# Altium project HallFieldMeter.PrjPCB
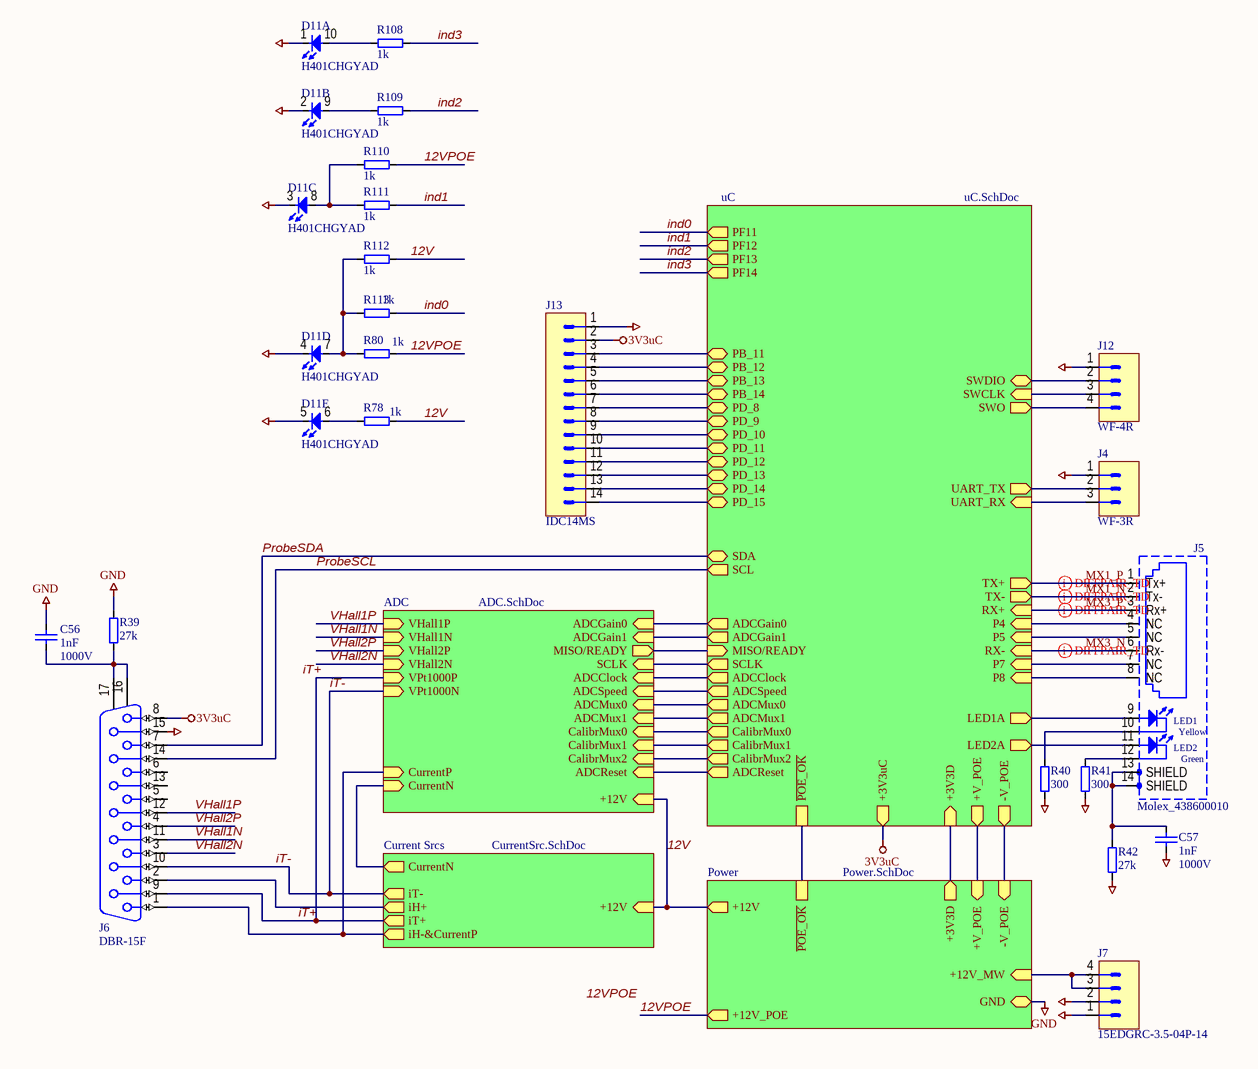
[diagram p0: main.SchDoc]
5 sheets, 296 parts. Net scope: hierarchical (ports join the sheet entries above them; power ports are global).
Board file: HallFM2_2.PcbDoc
Sheets:
  main.SchDoc
    ADC = ADC.SchDoc
    Current Srcs = CurrentSrc.SchDoc
    uC = uC.SchDoc
    Power = Power.SchDoc

## Sheet main.SchDoc
size 420 x 297 mm; Address1: Address1; Address2: Address2; Address3: Address3; Address4: Address4; SheetNumber: 1; Scale: 1:1; Разраб.: Иванов; Обозначение документа: АБВГ.123456.001 Э3; Пров.: Петров; Утв.: Сидоров; Наименование организации: ОАО "Концерн "МПО-Гидроприбор"; Перв. применение: АБВГ.123456.000; Наименование изделия 1: MAiN; Наименование изделия 2: Схема электрическая; Наименование изделия 3: принципиальная; Нач. отд.: Нач. отд.; Фамилия нач. отд.: Сидоров

### Parts
C56  1nF  Voltage: 1000V  [CAPC1206]
C57  1nF  Voltage: 1000V  [CAPC1206]
D11  H401CHGYAD  [H401CHGYAD_LED_CB]  (parts A,B,C,D,E of 5)
J4  WF-3R  [MOLEX_22-05-7038]
J5  Molex_438600010  [Molex-43860-0010]
J6  DBR-15F  [AMPHENOL_L717DFA15S1ATN]
J7  15EDGRC-3.5-04P-14  [TE_284512-4]
J12  WF-4R  [MOLEX_WF4-angle]
J13  IDC14MS  [3M_2514-6002RB]
R39  27k  [SMD0805RES]
R40  300  [RESC1608X64N]
R41  300  [RESC1608X64N]
R42  27k  [SMD0805RES]
R78  1k  [SMD0805RES]
R80  1k  [SMD0805RES]
R108  1k  [SMD0805RES]
R109  1k  [SMD0805RES]
R110  1k  [SMD0805RES]
R111  1k  [SMD0805RES]
R112  1k  [SMD0805RES]
R113  1k  [SMD0805RES]

### Sub-sheets
ADC = ADC.SchDoc: ADCGain1 (in), ADCGain0 (in), MISO/READY (out), SCLK (in), ADCClock (in), ADCSpeed (in), ADCMux0 (in), ADCMux1 (in), CalibrMux0 (in), CalibrMux1 (in), CalibrMux2 (in), +12V (in), VHall1P (in), VHall1N (in), VHall2P (in), VHall2N (in), CurrentP (in), CurrentN (in), VPt1000P (in), VPt1000N (in), ADCReset (in)
Current Srcs = CurrentSrc.SchDoc: +12V (in), iH-&CurrentP (out), iT+ (out), iH+ (out), CurrentN (out), iT- (out)
Power = Power.SchDoc: +V_POE (in), -V_POE (in), +12V_MW (in), GND (bidir), +3V3D (out), +12V (out), ~{POE_OK}, +12V_POE (out)
uC = uC.SchDoc: TX+ (out), TX- (out), RX+ (in), P4 (in), P5 (in), RX- (in), P7 (in), P8 (in), LED1A (out), LED2A (out), +V_POE (out), -V_POE (out), +3V3D (in), UART_TX (out), UART_RX (in), ADCGain0 (out), ADCGain1 (out), MISO/READY (in), SCLK (out), ADCClock (out), ADCSpeed (out), ADCMux0 (out), ADCMux1 (out), CalibrMux0 (out), CalibrMux1 (out), CalibrMux2 (out), SDA (bidir), SCL (out), ADCReset (out), ~{POE_OK}, +3V3uC (out), SWO (out), SWCLK (in), SWDIO (bidir), PD_15 (bidir), PD_14 (bidir), PD_13 (bidir), PD_12 (bidir), PD_11 (bidir), PD_10 (bidir), PD_9 (bidir), PD_8 (bidir), PB_14 (bidir), PB_13 (bidir), PB_12 (bidir), PB_11 (bidir), PF11 (out), PF12 (out), PF13 (out), PF14 (out)

### Nets
3V3uC: J6.8 J13.2 ; sheet uC/+3V3uC
GND: C56.1 C57.1 D11.1(C1) D11.2(C2) D11.3(C3) D11.4(C4) D11.5(C5) J4.1 J6.15 J7.1 J7.2 J12.1 J13.1 R39.2 R40.1 R41.1 R42.1 ; sheet Power/GND
12V: R78.2 R112.2 ; sheet ADC/+12V, sheet Current Srcs/+12V, sheet Power/+12V  [project net +12V]
12VPOE: R80.2 R110.2 ; sheet Power/+12V_POE  [project net +12V_POE]
Hal_current_2mA: J6.2 ; sheet Current Srcs/iH+
ind0: R113.2 ; sheet uC/PF11
ind1: R111.2 ; sheet uC/PF12
ind2: R109.2 ; sheet uC/PF13
ind3: R108.2 ; sheet uC/PF14
iT+: J6.9 ; sheet ADC/VPt1000P, sheet Current Srcs/iT+
iT-: J6.10 ; sheet ADC/VPt1000N, sheet Current Srcs/iT-
MX1_N: J5.2(Tx-) ; sheet uC/TX-
MX1_P: J5.1(Tx+) ; sheet uC/TX+
MX3_N: J5.6(Rx-) ; sheet uC/RX-
MX3_P: J5.3(Rx+) ; sheet uC/RX+
ProbeSCL: J6.14 ; sheet uC/SCL  [project net ProbeEEPROM_SCL]
ProbeSDA: J6.7 ; sheet uC/SDA  [project net ProbeEEPROM_SDA]
VHall1N: J6.11 ; sheet ADC/VHall1N
VHall1P: J6.12 ; sheet ADC/VHall1P
VHall2N: J6.3 ; sheet ADC/VHall2N
VHall2P: J6.4 ; sheet ADC/VHall2P
NetC56_2: C56.2 J6.16 J6.17 R39.1
NetC57_2: C57.2 J5.13(SHIELD) J5.14(SHIELD) R42.2
NetC60_2: sheet uC/+3V3D, sheet Power/+3V3D
NetD3_1: sheet uC/+V_POE, sheet Power/+V_POE
NetD3_3: sheet uC/-V_POE, sheet Power/-V_POE
NetD11_6: D11.6(A5) R78.1
NetD11_7: D11.7(A4) R80.1 R112.1 R113.1
NetD11_8: D11.8(A3) R110.1 R111.1
NetD11_9: D11.9(A2) R109.1
NetD11_10: D11.10(A1) R108.1
NetJ1_1: sheet ADC/CurrentN, sheet Current Srcs/CurrentN
NetJ4_2: J4.2 ; sheet uC/UART_TX
NetJ4_3: J4.3 ; sheet uC/UART_RX
NetJ5_4: J5.4(NC) ; sheet uC/P4
NetJ5_5: J5.5(NC) ; sheet uC/P5
NetJ5_7: J5.7(NC) ; sheet uC/P7
NetJ5_8: J5.8(NC) ; sheet uC/P8
NetJ5_9: J5.9(ALED1) ; sheet uC/LED1A
NetJ5_10: J5.10(CLED1) R40.2
NetJ5_11: J5.11(ALED2) ; sheet uC/LED2A
NetJ5_12: J5.12(CLED2) R41.2
NetJ6_1: J6.1 ; sheet ADC/CurrentP, sheet Current Srcs/iH-&CurrentP
NetJ7_3: J7.3 J7.4 ; sheet Power/+12V_MW
NetJ12_2: J12.2 ; sheet uC/SWDIO
NetJ12_3: J12.3 ; sheet uC/SWCLK
NetJ12_4: J12.4 ; sheet uC/SWO
NetJ13_3: J13.3 ; sheet uC/PB_11
NetJ13_4: J13.4 ; sheet uC/PB_12
NetJ13_5: J13.5 ; sheet uC/PB_13
NetJ13_6: J13.6 ; sheet uC/PB_14
NetJ13_7: J13.7 ; sheet uC/PD_8
NetJ13_8: J13.8 ; sheet uC/PD_9
NetJ13_9: J13.9 ; sheet uC/PD_10
NetJ13_10: J13.10 ; sheet uC/PD_11
NetJ13_11: J13.11 ; sheet uC/PD_12
NetJ13_12: J13.12 ; sheet uC/PD_13
NetJ13_13: J13.13 ; sheet uC/PD_14
NetJ13_14: J13.14 ; sheet uC/PD_15
NetQ2_4: sheet uC/~{POE_OK}, sheet Power/~{POE_OK}
NetR13_2: sheet ADC/ADCGain1, sheet uC/ADCGain1
NetR15_2: sheet ADC/ADCGain0, sheet uC/ADCGain0
NetR16_2: sheet ADC/MISO/READY, sheet uC/MISO/READY
NetR17_2: sheet ADC/SCLK, sheet uC/SCLK
NetR18_2: sheet ADC/ADCReset, sheet uC/ADCReset
NetR21_1: sheet ADC/ADCClock, sheet uC/ADCClock
NetR24_2: sheet ADC/ADCSpeed, sheet uC/ADCSpeed
NetR26_2: sheet ADC/ADCMux0, sheet uC/ADCMux0
NetR27_2: sheet ADC/ADCMux1, sheet uC/ADCMux1
NetR36_1: sheet ADC/CalibrMux0, sheet uC/CalibrMux0
NetR37_1: sheet ADC/CalibrMux1, sheet uC/CalibrMux1
NetR38_1: sheet ADC/CalibrMux2, sheet uC/CalibrMux2

Not connected (* = marked no-connect by the designer): J6 5 6 13

### Layout directives
differential pair: MX1_N, MX1_P, MX3_N, MX3_P

### Notes on the sheet
- Labels drawn without touching a wire or pin: 12VPOE, iT+
- Перв. примен.
- Справ. №
- Подп. и дата
- Инв. № дубл.
- Взам. инв. №
- Разраб.
- Изм.
- Лист
- № докум.
- Подп.
- Дата
- Лит.
- Масса
- Масштаб
- Пров.
- Т.контр.
- Листов
- Инв. № подл.
- Утв.
- Н.контр.
- Копировал
- Формат А3
- (in symbol Molex_438600010) LED1; Yellow; LED2; Green

### Library data of the parts
C56 C57 = C1206: Чип конденсатор 1206; Vendor: Vishay; DielectricType: X5R; SMD Solders: 2; Solder Option: RM; Tolerance: 1%; Pkg: SMD1206; Device: Cap1206; Value: 1nF; Price: 2
D11 = H401CHGYAD: 4LEDs сборка; Vendor: BIVAR; Value: HGYAD; SMD Solders: 0; Solder Option: RM; Pkg: SMD0603; Device: H401C; THD Solders: 8; Price: 700; Name to order: H401CHGYAD
J4 = WF3R: Вилка  WF3 угловая; Vendor: Confly; SMD Solders: 0; Solder Option: RM; THD Solders: 3; Price: 20; Device: WF-3R; Name to order: WF-3R
J5 = Molex_438600010: 1 Port, 8 Positions, CAT5 RJ45 Modular Connector With Yellow And Green fibers for LEDs; Vendor: Molex; SMD Solders: 4; Solder Option: RM; THD Solders: 10; Price: 320; Pkg: Molex_438600010; Device: Molex_438600010; Name to order: 438600010
J6 = D_SUB_15F: Вилка  DSUB 9 угловая; Vendor: Connfly; SMD Solders: 0; Solder Option: RM; THD Solders: 17; Name to order: DRB- 15MA (DBR-15F) (DS1037-15F); Price: 50; Device: DBR-15F
J7 = 15EDGRC-3.5-04P-14: Вилка  WF4; Vendor: Degson; SMD Solders: 0; Solder Option: RM; THD Solders: 4; Price: 50; Device: 15EDGRC-3.5-04P-14; Name to order: 15EDGRC-3.5-04P-14
J12 = WF4R: Вилка  WF4 угловая; Vendor: Confly; SMD Solders: 0; Solder Option: RM; THD Solders: 4; Price: 20; Device: WF-4R; Name to order: WF-4R
J13 = IDC14MS: Вилка  14конт., шаг: 2.54мм; Vendor: Connfly; SMD Solders: 0; Solder Option: RM; THD Solders: 14; Name to order: BH-14, DS1013-14S, IDC-14MS; Price: 30; Device: IDC14MS
R39 R42 R78 R80 R108-R113 = R0805: Чип резистор 0805; Vendor: Vishay; SMD Solders: 2; Solder Option: RM; TC: 100ppm/C; Tolerance: 1%; Pkg: SMD0805; Pwr: 125mW; Device: Res0805; Price: 2
  R39 R42: Value: 27k
  R78 R80 R108-R113: Value: 1k
R40 R41 = R0603: Чип резистор 0603; Vendor: Vishay; SMD Solders: 2; Solder Option: RM; TC: 100ppm/C; Tolerance: 1%; Pkg: SMD0603; Pwr: 60mW; Device: Res603; Price: 2; Value: 300

## Sheet ADC.SchDoc
size 420 x 297 mm; Address1: Address1; Address2: Address2; Address3: Address3; Address4: Address4; SheetNumber: 1; Scale: 1:1; Разраб.: Иванов; Обозначение документа: ADC; Пров.: Петров; Утв.: Сидоров; Наименование организации: ОАО "Концерн "МПО-Гидроприбор"; Перв. применение: АБВГ.123456.000; Наименование изделия 1: Плата; Наименование изделия 2: Схема электрическая; Наименование изделия 3: принципиальная; Нач. отд.: Нач. отд.; Фамилия нач. отд.: Сидоров
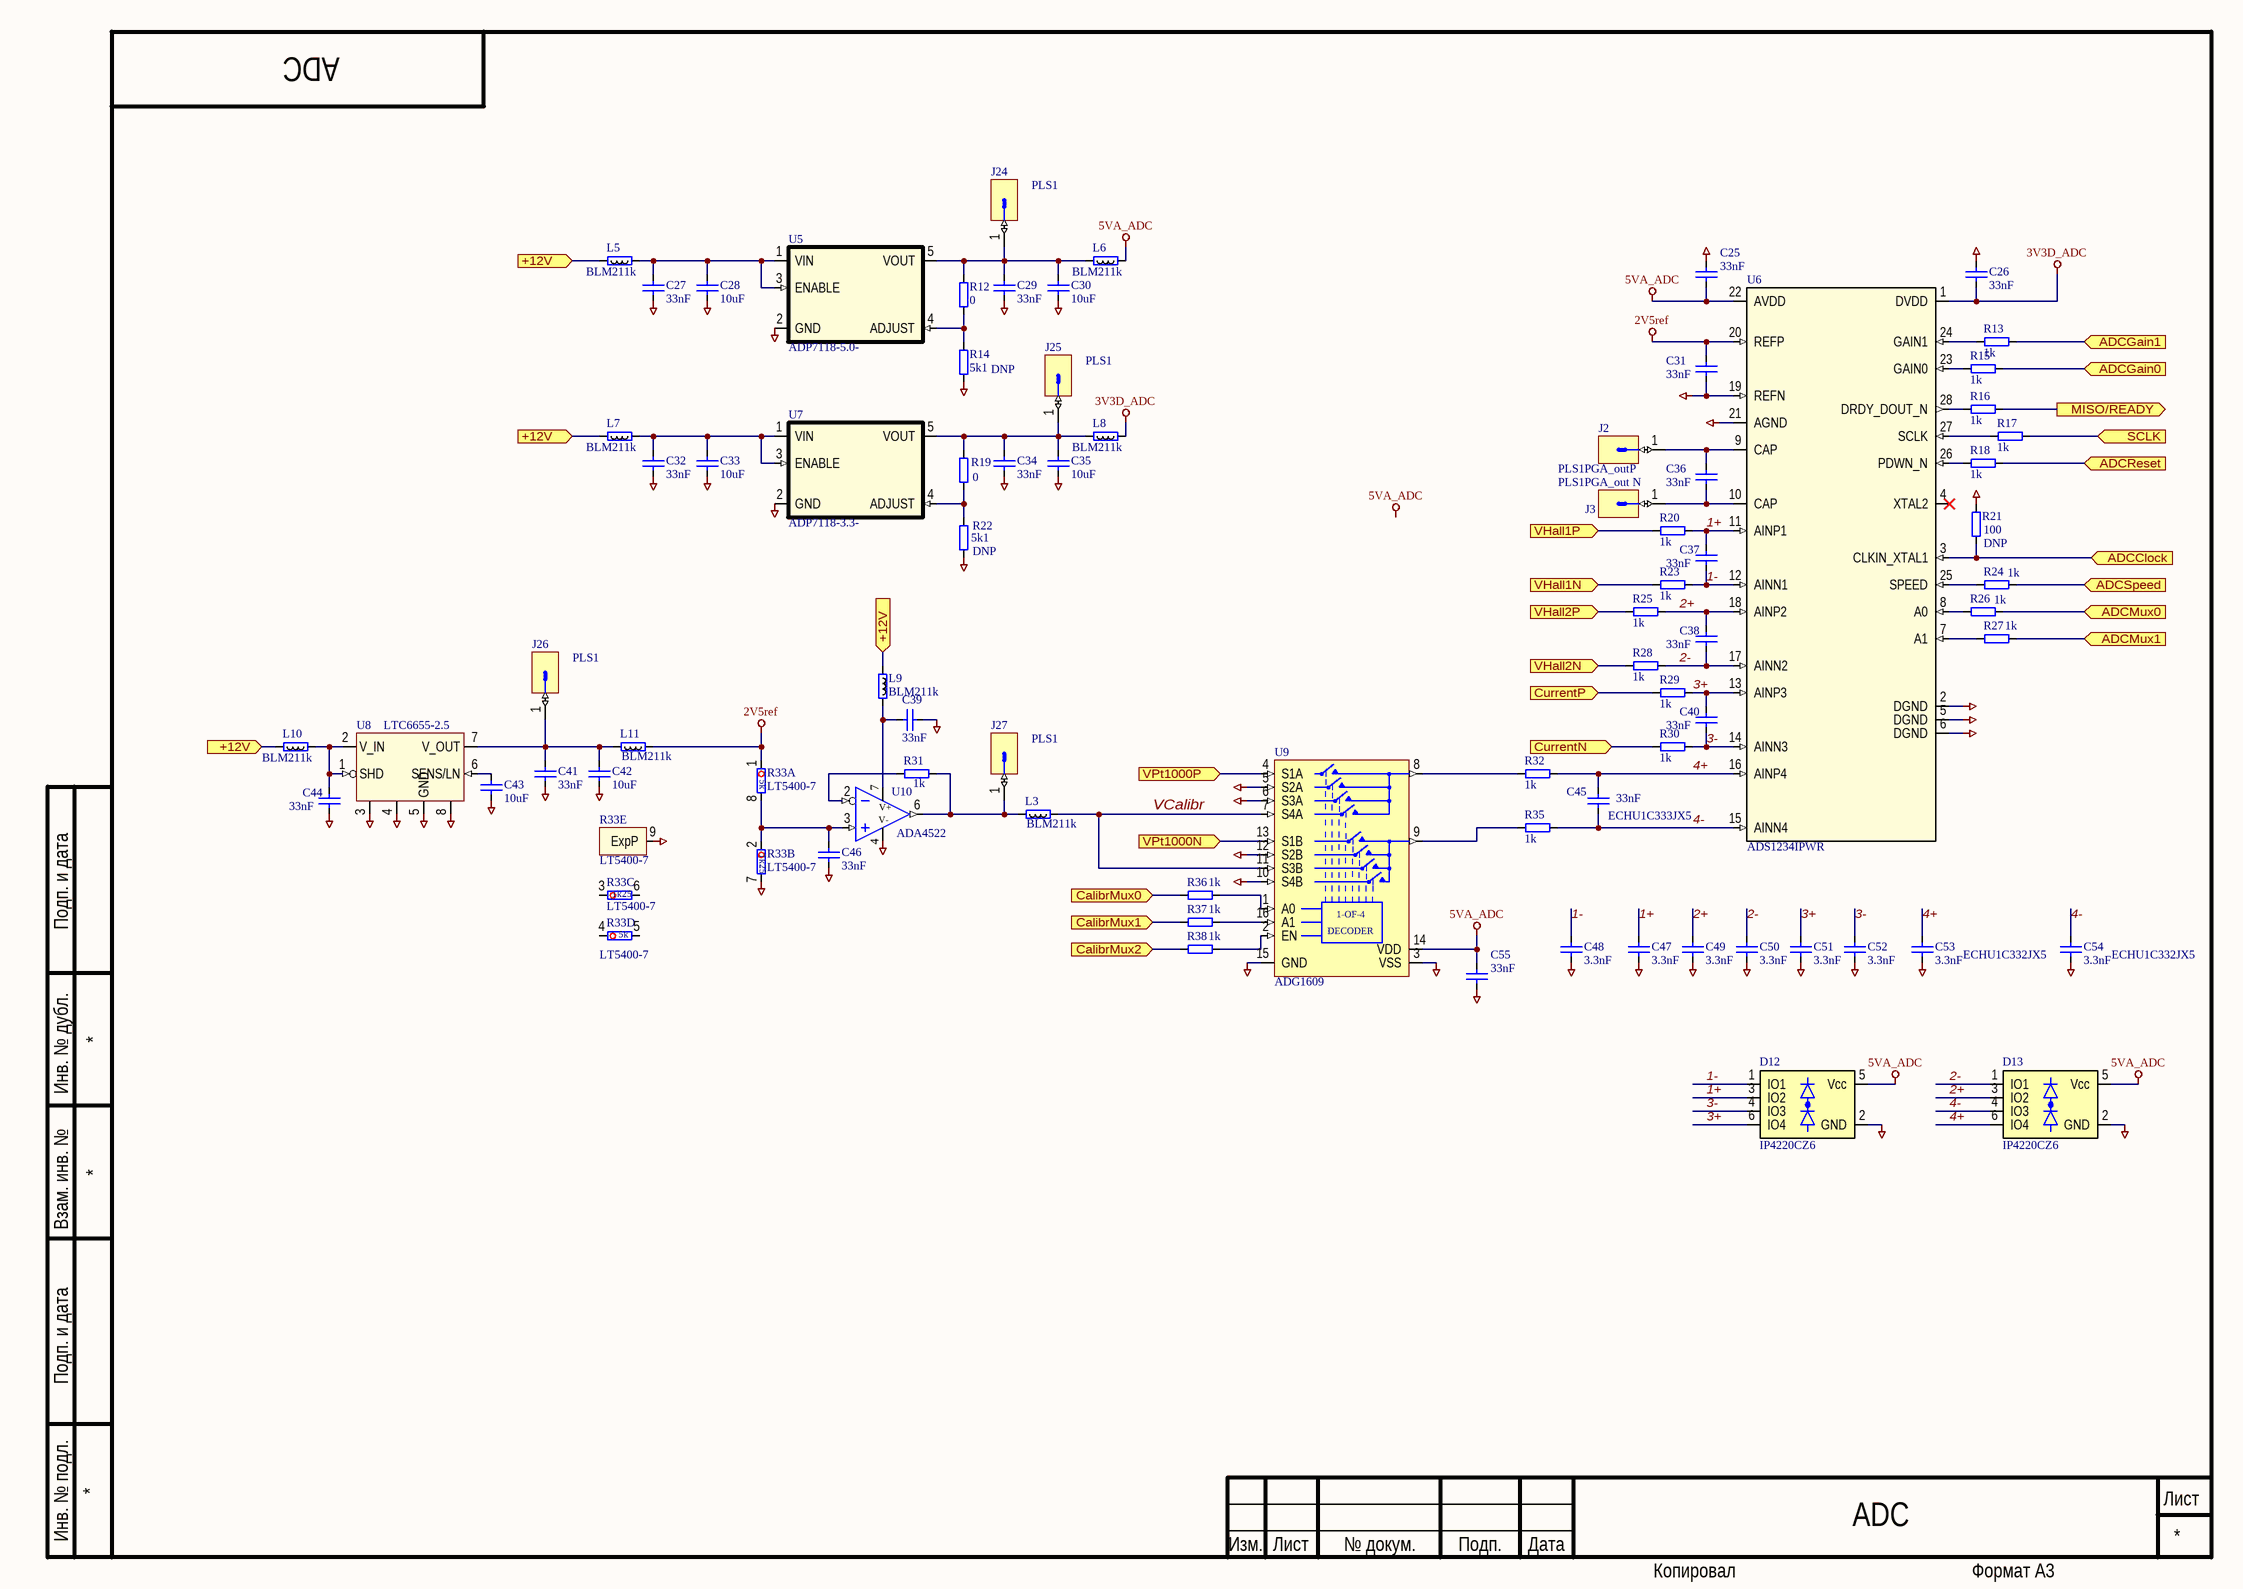
[diagram p1: ADC.SchDoc]

### Parts
C25  33nF  [CAPC1608X87N]
C26  33nF  [CAPC1608X87N]
C27  33nF  [SMD0805CAP]
C28  10uF  [SMD0805CAP]
C29  33nF  [SMD0805CAP]
C30  10uF  [SMD0805CAP]
C31  33nF  [CAPC1608X87N]
C32  33nF  [SMD0805CAP]
C33  10uF  [SMD0805CAP]
C34  33nF  [SMD0805CAP]
C35  10uF  [SMD0805CAP]
C36  33nF  [CAPC1608X87N]
C37  33nF  [CAPC1608X87N]
C38  33nF  [CAPC1608X87N]
C39  33nF  [SMD0805CAP]
C40  33nF  [CAPC1608X87N]
C41  33nF  [SMD0805CAP]
C42  10uF  [SMD0805CAP]
C43  10uF  [SMD0805CAP]
C44  33nF  [SMD0805CAP]
C45  33nF  Name to order: ECHU1C333JX5  [CAPC1206]
C46  33nF  [SMD0805CAP]
C47  3.3nF  [CAPC1608X87N]
C48  3.3nF  [CAPC1608X87N]
C49  3.3nF  [CAPC1608X87N]
C50  3.3nF  [CAPC1608X87N]
C51  3.3nF  [CAPC1608X87N]
C52  3.3nF  [CAPC1608X87N]
C53  3.3nF  Name to order: ECHU1C332JX5  [SMD0805CAP]
C54  3.3nF  Name to order: ECHU1C332JX5  [SMD0805CAP]
C55  33nF  [CAPC1608X87N]
D12  IP4220CZ6  [SOT95P270X145-6N]
D13  IP4220CZ6  [SOT95P270X145-6N]
J2  PLS1PGA_outP  [PLS1]
J3  PLS1PGA_out N  [PLS1]
J24  PLS1  [PLS1]
J25  PLS1  [PLS1]
J26  PLS1  [PLS1]
J27  PLS1  [PLS1]
L3  BLM211k  [RESC2012X50N]
L5  BLM211k  [RESC2012X50N]
L6  BLM211k  [RESC2012X50N]
L7  BLM211k  [RESC2012X50N]
L8  BLM211k  [RESC2012X50N]
L9  BLM211k  [RESC2012X50N]
L10  BLM211k  [RESC2012X50N]
L11  BLM211k  [RESC2012X50N]
R12  0  [SMD0805RES]
R13  1k  [SMD0805RES]
R14  5k1  Solder Option: DNP  [SMD0805RES]
R15  1k  [SMD0805RES]
R16  1k  [SMD0805RES]
R17  1k  [SMD0805RES]
R18  1k  [SMD0805RES]
R19  0  [SMD0805RES]
R20  1k  [SMD0805RES]
R21  100  Solder Option: DNP  [SMD0805RES]
R22  5k1  Solder Option: DNP  [SMD0805RES]
R23  1k  [SMD0805RES]
R24  1k  [SMD0805RES]
R25  1k  [SMD0805RES]
R26  1k  [SMD0805RES]
R27  1k  [SMD0805RES]
R28  1k  [SMD0805RES]
R29  1k  [SMD0805RES]
R30  1k  [SMD0805RES]
R31  1k  [SMD0805RES]
R32  1k  [SMD0805RES]
R33  LT5400-7  [SOP65P488X110-9N-R178X241]  (parts A,B,C,D,E of 5)
R35  1k  [SMD0805RES]
R36  1k  [SMD0805RES]
R37  1k  [SMD0805RES]
R38  1k  [SMD0805RES]
U5  ADP7118-5.0-  [SOT23-5]
U6  ADS1234IPWR  [SOP65P780X200-28N]
U7  ADP7118-3.3-  [SOT23-5]
U8  LTC6655-2.5  [SOP65P488X110-8N]
U9  ADG1609  [TSSOP-16]
U10  ADA4522  [SOP65P488X110-8N]

### Ports
+12V (in), ADCClock (in), ADCGain0 (in), ADCGain1 (in), ADCMux0 (in), ADCMux1 (in), ADCReset (in), ADCSpeed (in), CalibrMux0 (in), CalibrMux1 (in), CalibrMux2 (in), CurrentN (in), CurrentP (in), MISO/READY (out), SCLK (in), VHall1N (in), VHall1P (in), VHall2N (in), VHall2P (in), VPt1000N (in), VPt1000P (in)

### Nets
2V5ref: C31.2 L11.2 R33.1 U6.20(REFP)
3V3D_ADC: C26.1 L8.2 U6.1(DVDD)
5VA_ADC: C25.1 C55.2 D12.5(Vcc) D13.5(Vcc) L6.2 U6.22(AVDD) U9.14(VDD)
GND: C25.2 C26.2 C27.1 C28.1 C29.1 C30.1 C31.1 C32.1 C33.1 C34.1 C35.1 C39.1 C41.1 C42.1 C43.1 C44.1 C46.1 C47.1 C48.1 C49.1 C50.1 C51.1 C52.1 C53.1 C54.1 C55.1 D12.2(GND) D13.2(GND) R14.1 R21.2 R22.1 R33.7 R33.9(ExpP) U5.2(GND) U6.2(DGND) U6.5(DGND) U6.6(DGND) U6.19(REFN) U6.21(AGND) U7.2(GND) U8.3(GND) U8.4(GND) U8.5(GND) U8.8(GND) U9.3(VSS) U9.5(S2A) U9.6(S3A) U9.10(S4B) U9.12(S2B) U9.15(GND) U10.4(V-)
1+: C37.2 C47.2 D12.3(IO2) R20.2 U6.11(AINP1)
1-: C37.1 C48.2 D12.1(IO1) R23.2 U6.12(AINN1)
2+: C38.2 C49.2 D13.3(IO2) R25.2 U6.18(AINP2)
2-: C38.1 C50.2 D13.1(IO1) R28.2 U6.17(AINN2)
3+: C40.2 C51.2 D12.6(IO4) R29.2 U6.13(AINP3)
3-: C40.1 C52.2 D12.4(IO3) R30.2 U6.14(AINN3)
4+: C45.2 C53.2 D13.6(IO4) R32.2 U6.16(AINP4)
4-: C45.1 C54.2 D13.4(IO3) R35.2 U6.15(AINN4)
+12V: L5.1 L7.1 L9.2 L10.1 ; port +12V
iT+: U9.4(S1A) ; port VPt1000P
iT-: U9.13(S1B) ; port VPt1000N
VCalibr: L3.2 U9.7(S4A) U9.11(S3B)
VHall1N: R23.1 ; port VHall1N
VHall1P: R20.1 ; port VHall1P
VHall2N: R28.1 ; port VHall2N
VHall2P: R25.1 ; port VHall2P
NetC27_2: C27.2 C28.2 L5.2 U5.1(VIN) U5.3(ENABLE)
NetC29_2: C29.2 C30.2 J24.1 L6.1 R12.2 U5.5(VOUT)
NetC32_2: C32.2 C33.2 L7.2 U7.1(VIN) U7.3(ENABLE)
NetC34_2: C34.2 C35.2 J25.1 L8.1 R19.2 U7.5(VOUT)
NetC36_1: C36.1 J3.1 U6.10(CAP)
NetC36_2: C36.2 J2.1 U6.9(CAP)
NetC39_2: C39.2 L9.1 U10.7(V+)
NetC41_2: C41.2 C42.2 J26.1 L11.1 U8.7(V_OUT)
NetC43_2: C43.2 U8.6(SENS/LN)
NetC44_2: C44.2 L10.2 U8.1(SHD) U8.2(V_IN)
NetC46_2: C46.2 R33.2 R33.8 U10.3(IN+)
NetJ1_1: R30.1 ; port CurrentN
NetJ6_1: R29.1 ; port CurrentP
NetJ27_1: J27.1 L3.1 R31.2 U10.6(OUT)
NetR12_1: R12.1 R14.2 U5.4(ADJUST)
NetR13_1: R13.1 U6.24(GAIN1)
NetR13_2: R13.2 ; port ADCGain1
NetR15_1: R15.1 U6.23(GAIN0)
NetR15_2: R15.2 ; port ADCGain0
NetR16_1: R16.1 U6.28(DRDY_DOUT_N)
NetR16_2: R16.2 ; port MISO/READY
NetR17_1: R17.1 U6.27(SCLK)
NetR17_2: R17.2 ; port SCLK
NetR18_1: R18.1 U6.26(PDWN_N)
NetR18_2: R18.2 ; port ADCReset
NetR19_1: R19.1 R22.2 U7.4(ADJUST)
NetR21_1: R21.1 U6.3(CLKIN_XTAL1) ; port ADCClock
NetR24_1: R24.1 U6.25(SPEED)
NetR24_2: R24.2 ; port ADCSpeed
NetR26_1: R26.1 U6.8(A0)
NetR26_2: R26.2 ; port ADCMux0
NetR27_1: R27.1 U6.7(A1)
NetR27_2: R27.2 ; port ADCMux1
NetR31_1: R31.1 U10.2(IN-)
NetR32_1: R32.1 U9.8(DA)
NetR35_1: R35.1 U9.9(DB)
NetR36_1: R36.1 ; port CalibrMux0
NetR36_2: R36.2 U9.1(A0)
NetR37_1: R37.1 ; port CalibrMux1
NetR37_2: R37.2 U9.16(A1)
NetR38_1: R38.1 ; port CalibrMux2
NetR38_2: R38.2 U9.2(EN)

Not connected (* = marked no-connect by the designer): R33 3 4 5 6; U6 4(XTAL2)*

### Notes on the sheet
- Labels drawn without touching a wire or pin: 5VA_ADC
- Подп. и дата
- Инв. № дубл.
- Взам. инв. №
- Инв. № подл.
- Изм.
- Лист
- № докум.
- Подп.
- Дата
- Копировал
- Формат А3
- (in symbol ADG1609) 1-OF-4; DECODER
- (in symbol LT5400_7, part A) 5k
- (in symbol LT5400_7, part B) 1k25
- (in symbol LT5400_7, part C) 1k25
- (in symbol LT5400_7, part D) 5k

### Library data of the parts
C25 C26 C31 C36-C38 C40 C47-C52 C55 = C0603: Чип конденсатор 0603; Voltage: 50V; Vendor: Vishay; DielectricType: X5R; SMD Solders: 2; Solder Option: RM; Tolerance: 20%; Pkg: SMD0603; Device: Cap603; Price: 2
  C25 C26 C31 C36-C38 C40 C55: Value: 33nF
  C47-C52: Value: 3.3nF
C27-C30 C32-C35 C39 C41-C44 C46 C53 C54 = C0805: Чип конденсатор 0805; Voltage: 25V; Vendor: Vishay; DielectricType: X5R; SMD Solders: 2; Solder Option: RM; Tolerance: 20%; Pkg: SMD0805; Device: Cap0805; Price: 2
  C27 C29 C32 C34 C39 C41 C44 C46: Value: 33nF
  C28 C30 C33 C35 C42 C43: Value: 10uF
  C53 C54: Value: 3.3nF
C45 = C1206: Чип конденсатор 1206; Voltage: 16V; Vendor: Vishay; DielectricType: X5R; SMD Solders: 2; Solder Option: RM; Tolerance: 1%; Pkg: SMD1206; Device: Cap1206; Value: 33nF; Price: 2
D12 D13 = IP4220: Optotransistor; Pkg: SOT23-6; SMD Solders: 6; Solder Option: RM; THD Solders: 0; Vendor: NXP; Voltage: 6V; Device: IP4220CZ6; Price: 10; Name to order: IP4220CZ6; Current: 0
J2 J3 J24-J27 = PLS1: Штырь PLS1; Vendor: Confly; SMD Solders: 0; Solder Option: RM; THD Solders: 1; Price: 1; Device: PLS1
  J2: Value: PGA_outP
  J3: Value: PGA_out N
L3 L5-L11 = BLM21: SMD Ferrite bead 0805; Vendor: Vishay; Value: 1k; Pkg: SMD0805; SMD Solders: 2; Solder Option: RM; Price: 10; Device: BLM21
R12 R13 R15-R20 R23-R32 R35-R38 = R0805: as R39 on sheet main; Price: 2
  R12 R19: Value: 0
  R13 R15-R18 R20 R23-R32 R35-R38: Value: 1k
R14 R21 R22 = R0805: Чип резистор 0805; Vendor: Vishay; SMD Solders: 2; TC: 100ppm/C; Tolerance: 1%; Pkg: SMD0805; Pwr: 125mW; Device: Res0805; Price: 2
  R14 R22: Value: 5k1
  R21: Value: 100
R33 = LT5400_7: 4 прецизионных резистора; Vendor: Analog Devices; SMD Solders: 0; Solder Option: i; TC: 200ppb/C; Tolerance: 0..025%; Pkg: MSOP 9-0.65; Pwr: 40C/W; Device: LT5400; Name to order: LT5400BMPMS8E-7#PBF; Value: -7; Price: 2; THD Solders: 0
U5 = ADP7118: Positive LDO Linear stabilizer; Vendor: Analog Devoces; Value: -5.0-; SMD Solders: 5; Solder Option: RM; Name to order: ADP7118AUJZ-5.0-R7; Pkg: SOT23-5; Price: 100; Device: ADP7118
U6 = ADS1234: АЦП; Pkg: SOIC8_EP; SMD Solders: 28; Solder Option: RM; TC: 10-300nV/C; THD Solders: 0; Vendor: Texas  Instruments; Voltage: 2V7 to 5V3; Current: 3; Device: ADS1234; Price: 1500; Name to order: ADS1234IPWR
U7 = ADP7118: Positive LDO Linear stabilizer; Vendor: Analog Devoces; Value: -3.3-; SMD Solders: 5; Solder Option: RM; Name to order: ADP7118AUJZ-3.3-R7; Pkg: SOT23-5; Price: 100; Device: ADP7118
U8 = LTC6655B-5: Low noise precision reference,; Name to order: LTC6655LNBHMS8-2.5; Pkg: MSOP65-8; SMD Solders: 8; Solder Option: RM; TC: 2ppm/C; Value: -2.5; Vendor: Analog Devices Inc; Voltage: max13.2V; Price: 6000; Device: LTC6655
U9 = ADG1609: Мультиплексор аналоговый дифференциальный 4 канала; Vendor: Analog Devoces; Pkg: TSSOP65-16; SMD Solders: 16; Solder Option: RM; THD Solders: 0; Name to order: ADG1608BRUZ; Price: 700; Device: ADG1609; Current: 0
U10 = ADA4522: Op amp; Pkg: MASOP8-65; SMD Solders: 8; Solder Option: RM; TC: 1uV/C; Vendor: Analog Devices Inc; Voltage: +-5 to +-27.5V; Current: 1; Device: ADA4522; Price: 600

## Sheet CurrentSrc.SchDoc
size 420 x 297 mm; Address1: Address1; Address2: Address2; Address3: Address3; Address4: Address4; SheetNumber: 1; Scale: 1:1; Разраб.: Иванов; Обозначение документа: Current Srcs; Пров.: Петров; Утв.: Сидоров; Наименование организации: ОАО "Концерн "МПО-Гидроприбор"; Перв. применение: АБВГ.123456.000; Наименование изделия 1: Плата; Наименование изделия 2: Схема электрическая; Наименование изделия 3: принципиальная; Нач. отд.: Нач. отд.; Фамилия нач. отд.: Сидоров
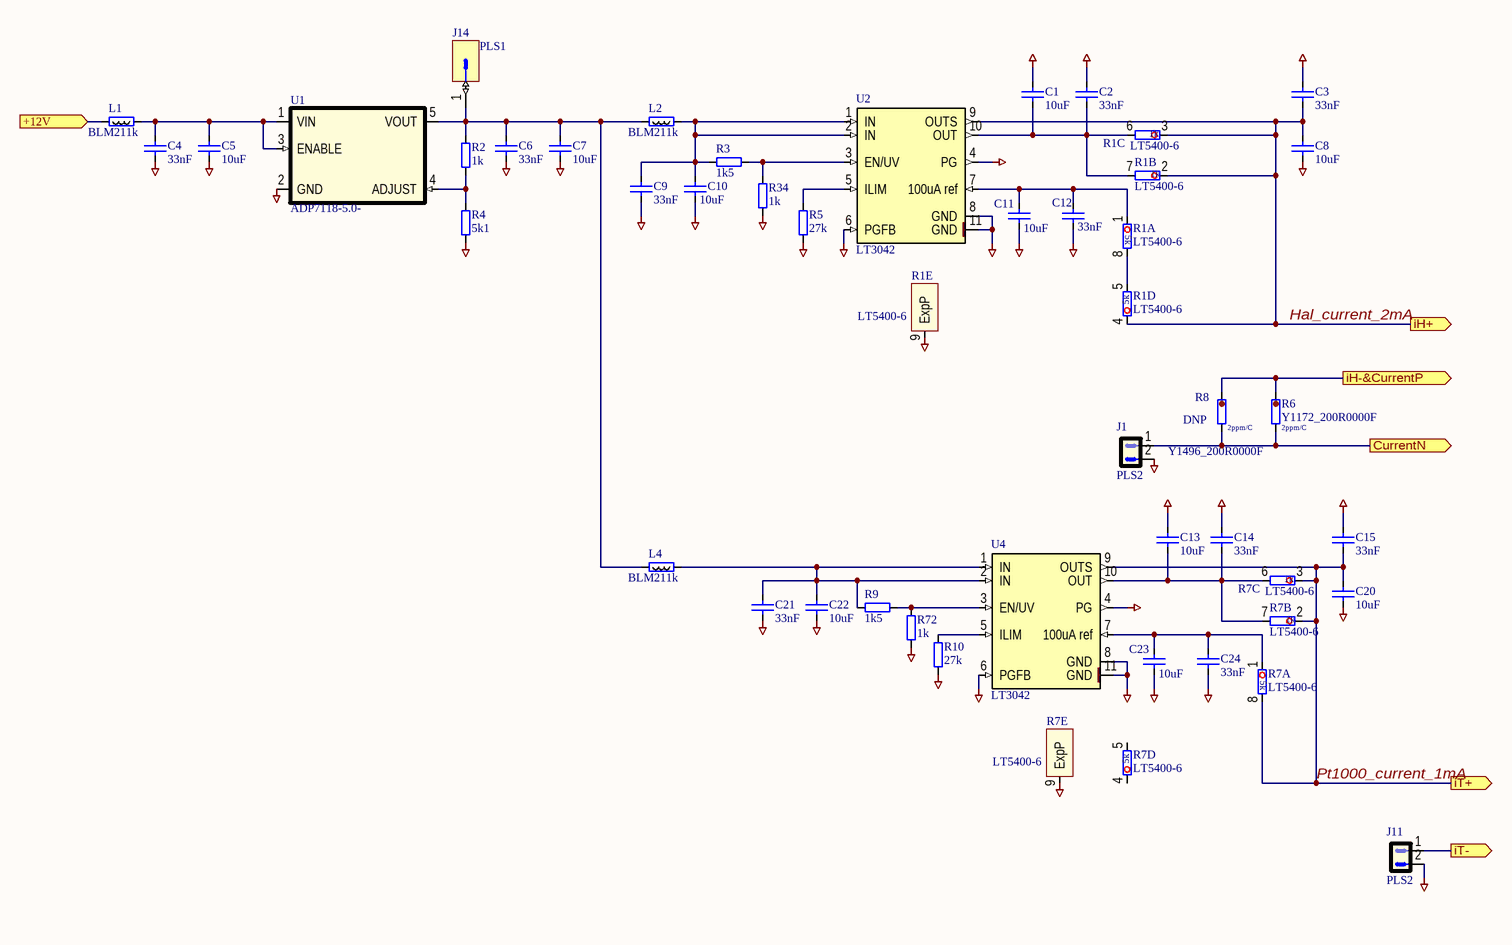
[diagram p2: CurrentSrc.SchDoc]

### Parts
C1  10uF  [SMD0805CAP]
C2  33nF  [SMD0805CAP]
C3  33nF  [SMD0805CAP]
C4  33nF  [SMD0805CAP]
C5  10uF  [SMD0805CAP]
C6  33nF  [SMD0805CAP]
C7  10uF  [SMD0805CAP]
C8  10uF  [SMD0805CAP]
C9  33nF  [SMD0805CAP]
C10  10uF  [SMD0805CAP]
C11  10uF  [SMD0805CAP]
C12  33nF  [SMD0805CAP]
C13  10uF  [SMD0805CAP]
C14  33nF  [SMD0805CAP]
C15  33nF  [SMD0805CAP]
C20  10uF  [SMD0805CAP]
C21  33nF  [SMD0805CAP]
C22  10uF  [SMD0805CAP]
C23  10uF  [SMD0805CAP]
C24  33nF  [CAPC1608X87N]
J1  PLS2  [PLS2]
J11  PLS2  [PLS2]
J14  PLS1  [PLS1]
L1  BLM211k  [RESC2012X50N]
L2  BLM211k  [RESC2012X50N]
L4  BLM211k  [RESC2012X50N]
R1  LT5400-6  [SOP65P488X110-9N-R178X241]  (parts A,B,C,D,E of 5)
R2  1k  [SMD0805RES]
R3  1k5  [SMD0805RES]
R4  5k1  [SMD0805RES]
R5  27k  [SMD0805RES]
R6  Y1172_200R0000F  TC: 2ppm/C  [SMD0805RES]
R7  LT5400-6  [SOP65P488X110-9N-R178X241]  (parts A,B,C,D,E of 5)
R8  Y1496_200R0000F  Solder Option: DNP  TC: 2ppm/C  [RESC3016X65N]
R9  1k5  [SMD0805RES]
R10  27k  [SMD0805RES]
R34  1k  [SMD0805RES]
R72  1k  [SMD0805RES]
U1  ADP7118-5.0-  [SOT23-5]
U2  LT3042  [SOP50P490X110-11N-R157X188]
U4  LT3042  [SOP50P490X110-11N-R157X188]

### Ports
+12V (in), CurrentN (out), iH+ (out), iH-&CurrentP (out), iT+ (out), iT- (out)

### Nets
GND: C1.2 C2.2 C3.1 C4.1 C5.1 C6.1 C7.1 C8.1 C9.1 C10.1 C11.1 C12.1 C13.2 C14.2 C15.1 C20.1 C21.1 C22.1 C23.1 C24.1 J1.2 J11.2 R1.9(ExpP) R4.1 R5.1 R7.9(ExpP) R10.1 R34.1 R72.1 U1.2(GND) U2.4(PG) U2.6(PGFB) U2.8(GND) U2.11(GND) U4.4(PG) U4.6(PGFB) U4.8(GND) U4.11(GND)
+12V: L1.1 ; port +12V
Hal_current_2mA: C3.2 C8.2 R1.2 R1.3 R1.4 U2.9(OUTS) ; port iH+
iT-: J11.1 ; port iT-
Pt1000_current_1mA: C15.2 C20.2 R7.2 R7.3 R7.8 U4.9(OUTS) ; port iT+  [project net iT+]
NetC1_1: C1.1 C2.1 R1.6 R1.7 U2.10(OUT)
NetC4_2: C4.2 C5.2 L1.2 U1.1(VIN) U1.3(ENABLE)
NetC6_2: C6.2 C7.2 J14.1 L2.1 L4.1 R2.2 U1.5(VOUT)
NetC9_2: C9.2 C10.2 L2.2 R3.1 U2.1(IN) U2.2(IN)
NetC11_2: C11.2 C12.2 R1.1 U2.7(100uA_ref)
NetC13_1: C13.1 C14.1 R7.6 R7.7 U4.10(OUT)
NetC21_2: C21.2 C22.2 L4.2 R9.1 U4.1(IN) U4.2(IN)
NetC23_2: C23.2 C24.2 R7.1 U4.7(100uA_ref)
NetJ1_1: J1.1 R6.1 R8.1 ; port CurrentN
NetJ6_1: R6.2 R8.2 ; port iH-&CurrentP
NetR1_5: R1.5 R1.8
NetR2_1: R2.1 R4.2 U1.4(ADJUST)
NetR3_2: R3.2 R34.2 U2.3(EN/UV)
NetR5_2: R5.2 U2.5(ILIM)
NetR9_2: R9.2 R72.2 U4.3(EN/UV)
NetR10_2: R10.2 U4.5(ILIM)

Not connected (* = marked no-connect by the designer): R7 4 5

### Notes on the sheet
- Подп. и дата
- Инв. № дубл.
- Взам. инв. №
- Инв. № подл.
- Изм.
- Лист
- № докум.
- Подп.
- Дата
- Копировал
- Формат А3
- (in symbol LT5400, part A) 5k
- (in symbol LT5400, part B) 1k
- (in symbol LT5400, part C) 1k
- (in symbol LT5400, part D) 5k

### Library data of the parts
C1-C15 C20-C23 = C0805: as C27 on sheet ADC; Price: 2
  C1 C5 C7 C8 C10 C11 C13 C20 C22 C23: Value: 10uF
  C2-C4 C6 C9 C12 C14 C15 C21: Value: 33nF
C24 = C0805: Чип конденсатор 0603; Voltage: 50V; Vendor: Vishay; DielectricType: X5R; SMD Solders: 2; Solder Option: RM; Tolerance: 20%; Pkg: SMD0603; Device: Cap603; Value: 33nF; Price: 2
J1 J11 = PLS2: Vendor: Confly; SMD Solders: 0; Solder Option: RM; THD Solders: 2; Price: 1; Device: PLS2
J14 = PLS1: as J2 on sheet ADC; Price: 1; Device: PLS1
L1 L2 L4 = BLM21: as L3 on sheet ADC; Price: 10; Device: BLM21
R1 R7 = LT5400: 4 прецизионных резистора; Vendor: Analog Devices; SMD Solders: 0; Solder Option: i; TC: 200ppb/C; Tolerance: 0..025%; Pkg: MSOP 9-0.65; Pwr: 40C/W; Name to order: LT5400BMPMS8E-6#PBF; Value: -6; Price: 2; Device: LT5400; THD Solders: 0
R2-R5 R9 R10 R34 R72 = R0805: as R39 on sheet main; Price: 2
  R2 R34 R72: Value: 1k
  R3 R9: Value: 1k5
  R4: Value: 5k1
  R5 R10: Value: 27k
R6 = Y1172: Прецизионный чип резистор 0805; Vendor: Vishay; SMD Solders: 2; Solder Option: RM; Tolerance: 1%; Pkg: SMD0805; Pwr: 125mW; Name to order: Y1172200R0000xxx; Price: 2; Value: 200R0000F; Device: Y1172
R8 = Y1496: Прецизионный чип резистор 1206; Vendor: Vishay; SMD Solders: 2; Tolerance: 1%; Pkg: SMD1206; Pwr: 125mW; Name to order: Y1172200R0000xxx; Price: 2; Value: 200R0000F; Device: Y1496
U1 = ADP7118: as U5 on sheet ADC; Pkg: SOT23-5; Price: 100; Device: ADP7118
U2 U4 = LT3042: Current source v 100uA ref; Name to order: LT3042EMSE; Pkg: MSOP10 PowPad; SMD Solders: 11; Solder Option: DiY; TC: 10ppm/C; THD Solders: 0; Tolerance: 1%; Vendor: Analog Devices Inc; Voltage: max 20V; Current: 200ma; Price: 1200; Device: LT3042

## Sheet uC.SchDoc
size 594 x 420 mm; Address1: Address1; Address2: Address2; Address3: Address3; Address4: Address4; SheetNumber: 1; Scale: 1:1; Разраб.: Иванов; Обозначение документа: uC; Пров.: Петров; Утв.: Сидоров; Наименование организации: ОАО "Концерн "МПО-Гидроприбор"; Перв. применение: АБВГ.123456.000; Наименование изделия 1: ujyjyjyj; Наименование изделия 2: Схема электрическая; Наименование изделия 3: принципиальная; Нач. отд.: Нач. отд.; Фамилия нач. отд.: Сидоров
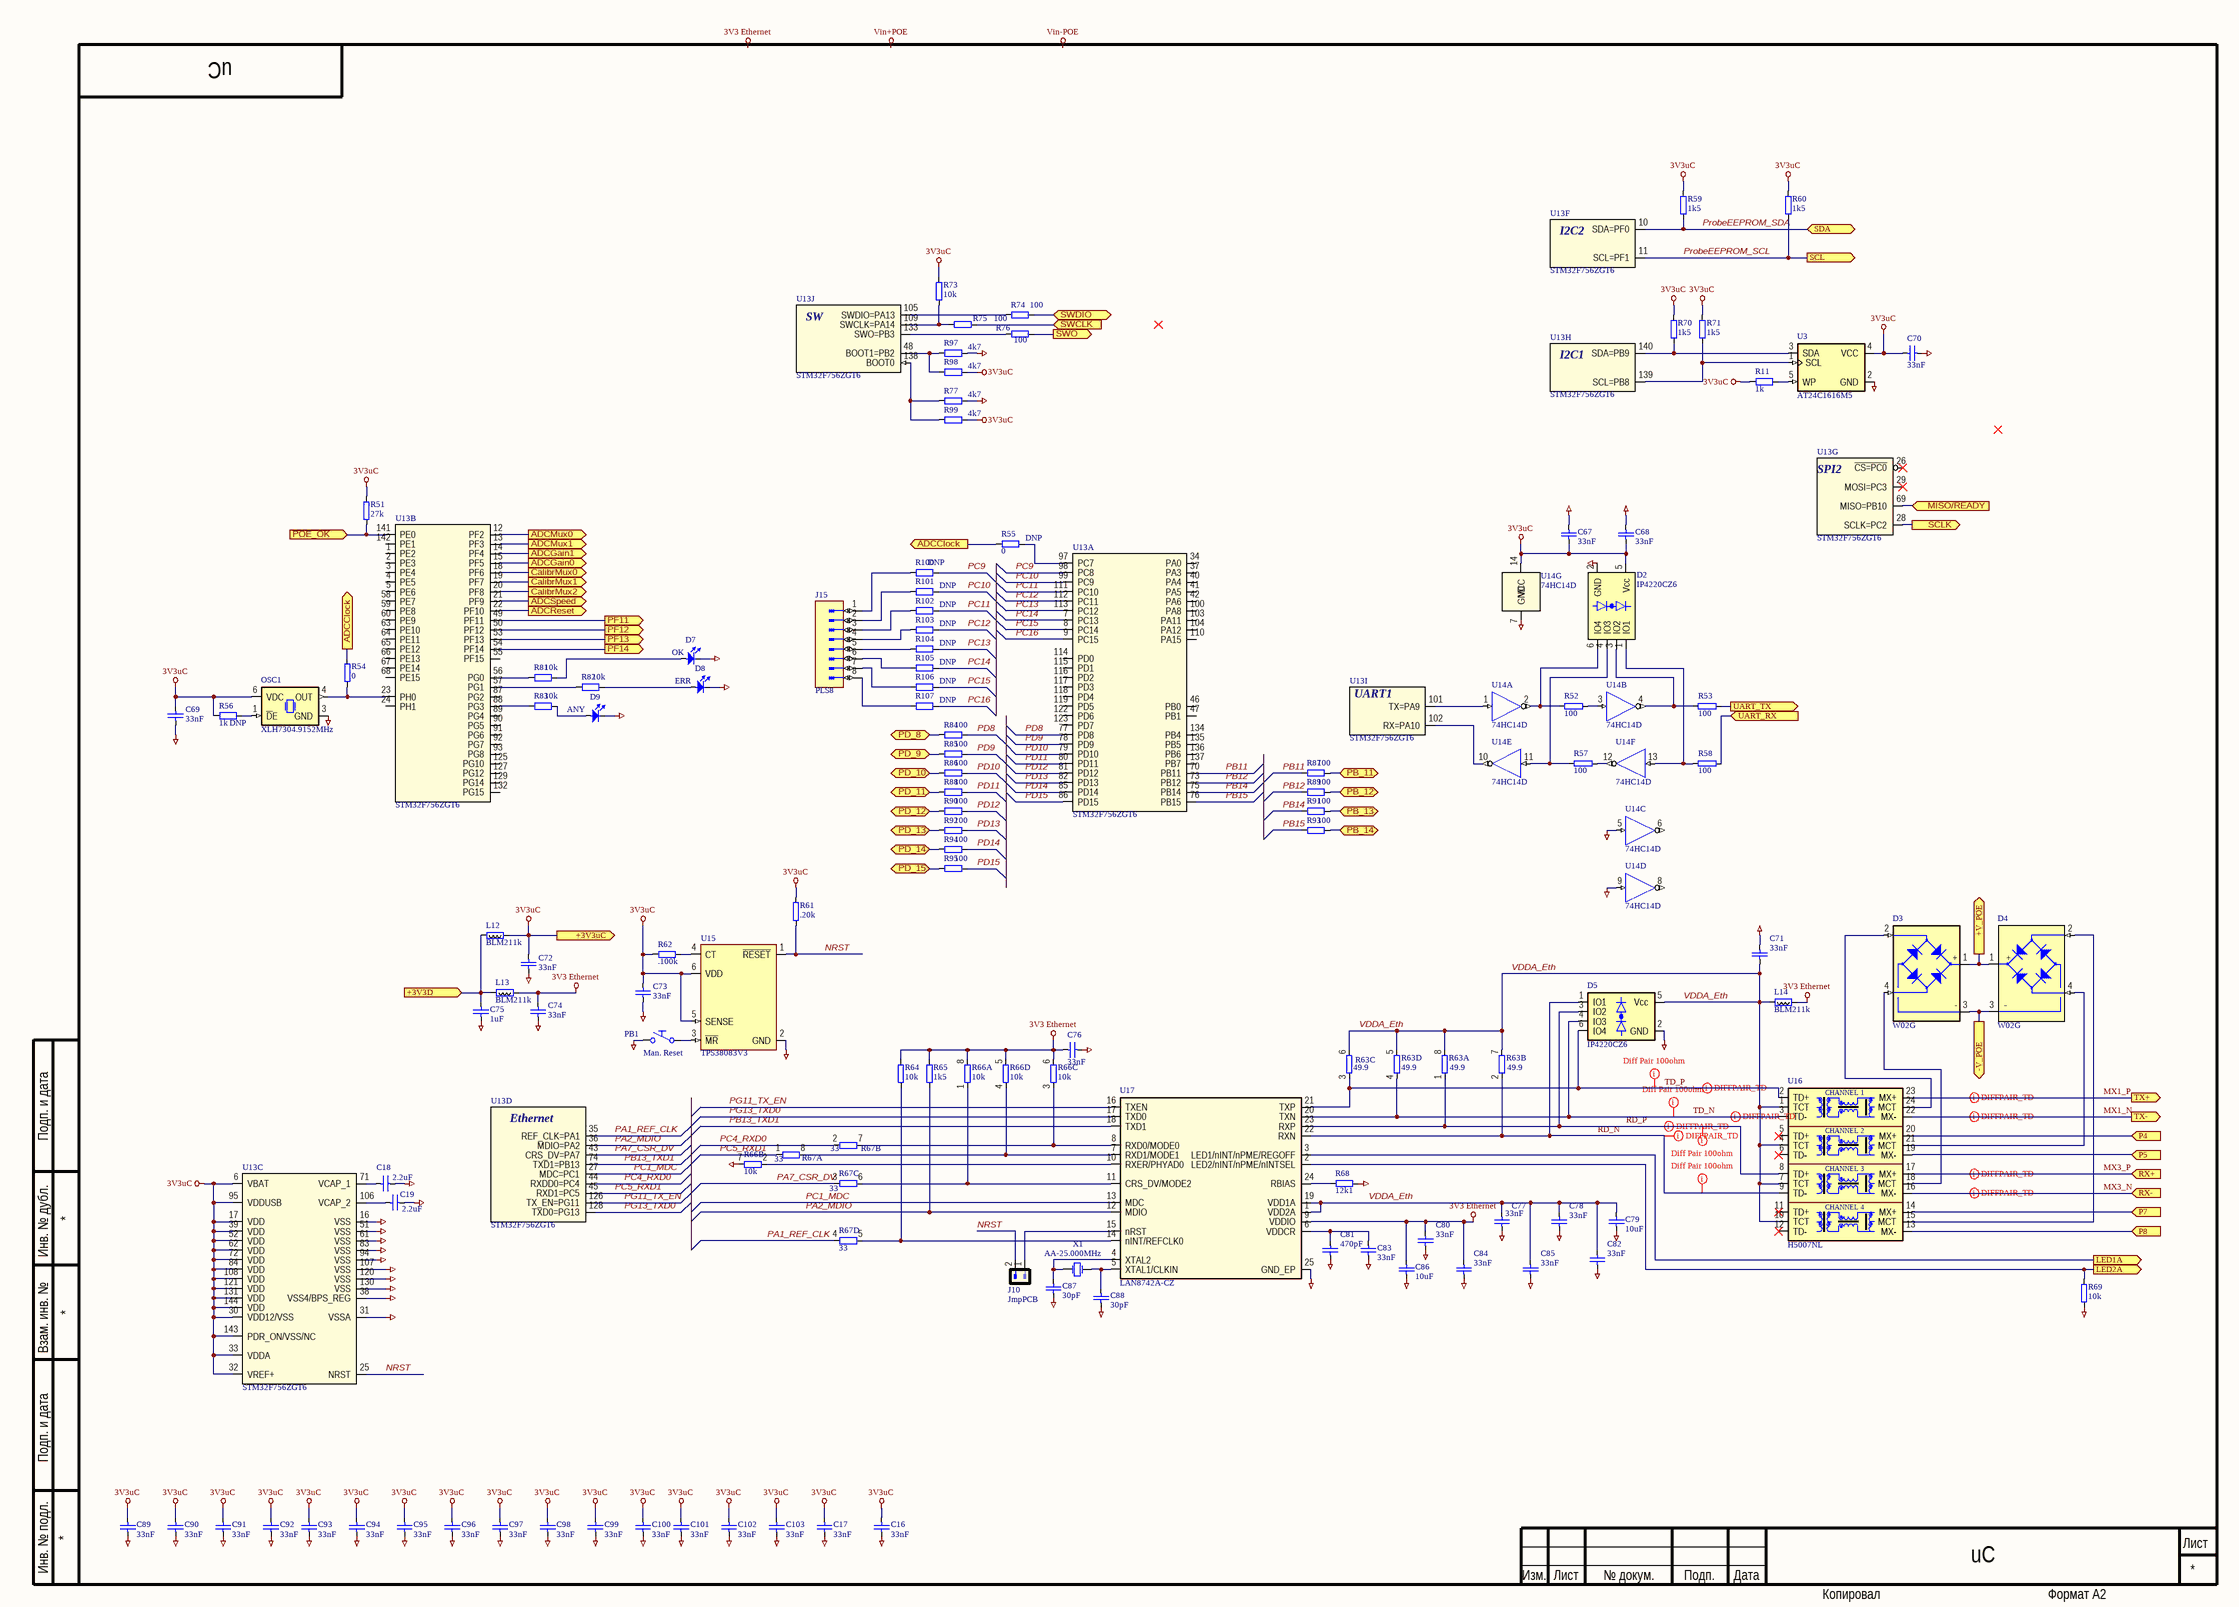
[diagram p3: uC.SchDoc]

### Parts
C16  33nF  [CAPC1608X87N]
C17  33nF  [CAPC1608X87N]
C18  2.2uF  [SMD0805CAP]
C19  2.2uF  [SMD0805CAP]
C67  33nF  [CAPC1608X87N]
C68  33nF  [CAPC1608X87N]
C69  33nF  [CAPC1608X87N]
C70  33nF  [CAPC1608X87N]
C71  33nF  [CAPC1608X87N]
C72  33nF  [CAPC1608X87N]
C73  33nF  [CAPC1608X87N]
C74  33nF  [CAPC1608X87N]
C75  1uF  [CAPC1608X87N]
C76  33nF  [CAPC1608X87N]
C77  33nF  [CAPC1608X87N]
C78  33nF  [CAPC1608X87N]
C79  10uF  [SMD0805CAP]
C80  33nF  [CAPC1608X87N]
C81  470pF  [CAPC1608X87N]
C82  33nF  [CAPC1608X87N]
C83  33nF  [CAPC1608X87N]
C84  33nF  [CAPC1608X87N]
C85  33nF  [CAPC1608X87N]
C86  10uF  [SMD0805CAP]
C87  30pF  [CAPC1608X87N]
C88  30pF  [CAPC1608X87N]
C89  33nF  [CAPC1608X87N]
C90  33nF  [CAPC1608X87N]
C91  33nF  [CAPC1608X87N]
C92  33nF  [CAPC1608X87N]
C93  33nF  [CAPC1608X87N]
C94  33nF  [CAPC1608X87N]
C95  33nF  [CAPC1608X87N]
C96  33nF  [CAPC1608X87N]
C97  33nF  [CAPC1608X87N]
C98  33nF  [CAPC1608X87N]
C99  33nF  [CAPC1608X87N]
C100  33nF  [CAPC1608X87N]
C101  33nF  [CAPC1608X87N]
C102  33nF  [CAPC1608X87N]
C103  33nF  [CAPC1608X87N]
D2  IP4220CZ6  [SOT95P270X145-6N]
D3  W02G  [RECTRON_RB15]
D4  W02G  [RECTRON_RB15]
D5  IP4220CZ6  [SOT95P270X145-6N]
D7  OK  [LED_OSRAM_LGR971]
D8  ERR  [LED_OSRAM_LOR976]
D9  ANY  [LED_OSRAM_LYR976]
J10  JmpPCB  [PCBJumper]
J15  PLS8  [COMATEL_386.0358.1.08.440]
L12  BLM211k  [RESC2012X50N]
L13  BLM211k  [RESC2012X50N]
L14  BLM211k  [RESC2012X50N]
OSC1  XLH7304.9152MHz  [OSC_PERICOM_FRETHE025]
PB1  value Man. Reset  [PB_ALPS_SKHHLQA010]  (hidden comment: 2-1825027-0)
R11  1k  [SMD0805RES]
R51  27k  [SMD0805RES]
R52  100  [SMD0805RES]
R53  100  [SMD0805RES]
R54  0  [SMD0805RES]
R55  0  Solder Option: DNP  [SMD0805RES]
R56  1k  Solder Option: DNP  [SMD0805RES]
R57  100  [SMD0805RES]
R58  100  [SMD0805RES]
R59  1k5  [RESC1608X64N]
R60  1k5  [RESC1608X64N]
R61  .20k  [RESC1608X64N]
R62  .100k  [RESC1608X64N]
R63  49.9  [CAY16x4]  (parts A,B,C,D of 4)
R64  10k  [RESC1608X64N]
R65  1k5  [RESC1608X64N]
R66  10k  [CAY16x4]  (parts A,B,C,D of 4)
R67  33  [CAY16x4]  (parts A,B,C,D of 4)
R68  12k1  [RESC1608X64N]
R69  10k  [RESC1608X64N]
R70  1k5  [RESC1608X64N]
R71  1k5  [SMD0805RES]
R73  10k  [SMD0805RES]
R74  100  [SMD0805RES]
R75  100  [SMD0805RES]
R76  100  [SMD0805RES]
R77  4k7  [RESC1608X64N]
R81  10k  [SMD0805RES]
R82  10k  [SMD0805RES]
R83  10k  [SMD0805RES]
R84  100  [SMD0805RES]
R85  100  [SMD0805RES]
R86  100  [SMD0805RES]
R87  100  [SMD0805RES]
R88  100  [SMD0805RES]
R89  100  [SMD0805RES]
R90  100  [SMD0805RES]
R91  100  [SMD0805RES]
R92  100  [SMD0805RES]
R93  100  [SMD0805RES]
R94  100  [SMD0805RES]
R95  100  [SMD0805RES]
R97  4k7  [RESC1608X64N]
R98  4k7  [RESC1608X64N]
R99  4k7  [RESC1608X64N]
R100  DNP  [RESC1608X64N]
R101  DNP  [RESC1608X64N]
R102  DNP  [RESC1608X64N]
R103  DNP  [RESC1608X64N]
R104  DNP  [RESC1608X64N]
R105  DNP  [RESC1608X64N]
R106  DNP  [RESC1608X64N]
R107  DNP  [RESC1608X64N]
U3  AT24C1616M5  [SOT23-5]
U13  STM32F756ZGT6  [LQFP-144_STM-M]  (parts A,B,C,D,F,G,H,I,J of 10)
U14  74HC14D  [SOIC127P600X175-14N]  (parts A,B,C,D,E,F,G of 7)
U15  TPS38083V3  [SOT95P270X145-6N]
U16  H5007NL  [XFMR_PULSE_H5007NL]
U17  LAN8742A-CZ  [QFN24_0R5_4X4]
X1  AA-25.000MHz  [XTAL_AA]

### Ports
+3V3D (in), +3V3uC (out), +V_POE (out), -V_POE (out), ADCClock (out), ADCGain0 (out), ADCGain1 (out), ADCMux0 (out), ADCMux1 (out), ADCReset (out), ADCSpeed (out), CalibrMux0 (out), CalibrMux1 (out), CalibrMux2 (out), LED1A (out), LED2A (out), MISO/READY (in), P4 (in), P5 (in), P7 (in), P8 (in), PB_11 (bidir), PB_12 (bidir), PB_13 (bidir), PB_14 (bidir), PD_8 (bidir), PD_9 (bidir), PD_10 (bidir), PD_11 (bidir), PD_12 (bidir), PD_13 (bidir), PD_14 (bidir), PD_15 (bidir), PF11 (out), PF12 (out), PF13 (out), PF14 (out), RX+ (in), RX- (in), SCL (out), SCLK (out), SDA (bidir), SWCLK (in), SWDIO (bidir), SWO (out), TX+ (out), TX- (out), UART_RX (in), UART_TX (out), ~{POE_OK} (in)

### Nets
3V3 Ethernet: C74.2 C76.2 C80.2 C84.2 C86.2 L13.2 L14.2 R64.1 R65.1 R66.5 R66.6 R66.8 U17.9(VDDIO)
3V3uC: C16.2 C17.2 C67.2 C68.2 C69.2 C70.1 C72.2 C73.2 C89.2 C90.2 C91.2 C92.2 C93.2 C94.2 C95.2 C96.2 C97.2 C98.2 C99.2 C100.2 C101.2 C102.2 C103.2 D2.5(Vcc) L12.2 OSC1.6(VDC) R11.2 R51.2 R56.1 R59.1 R60.1 R61.1 R62.1 R70.2 R71.2 R73.2 R98.2 R99.2 U3.4(VCC) U13.6(VBAT) U13.17(VDD) U13.30(VDD12/VSS) U13.32(VREF+) U13.33(VDDA) U13.39(VDD) U13.52(VDD) U13.62(VDD) U13.72(VDD) U13.84(VDD) U13.95(VDDUSB) U13.108(VDD) U13.121(VDD) U13.131(VDD) U13.143(PDR_ON/VSS/NC) U13.144(VDD) U14.14(VCC) U15.5(SENSE) U15.6(VDD) ; port +3V3uC
GND: C16.1 C17.1 C18.1 C19.1 C67.1 C68.1 C69.1 C70.2 C71.2 C72.1 C73.1 C74.1 C75.1 C76.1 C77.1 C78.1 C79.1 C80.1 C81.1 C82.1 C83.1 C84.1 C85.1 C86.1 C87.2 C88.2 C89.1 C90.1 C91.1 C92.1 C93.1 C94.1 C95.1 C96.1 C97.1 C98.1 C99.1 C100.1 C101.1 C102.1 C103.1 D2.2(GND) D5.2(GND) D7.1(C) D8.1(C) D9.1(C) OSC1.3(GND) PB1.2(NO) R66.7 R68.1 R69.2 R77.2 R97.2 U3.2(GND) U13.16(VSS) U13.31(VSSA) U13.38(VSS4/BPS_REG) U13.51(VSS) U13.61(VSS) U13.83(VSS) U13.94(VSS) U13.107(VSS) U13.120(VSS) U13.130(VSS) U14.5(IN) U14.7(GND) U14.9(IN) U15.2(GND) U17.25(GND_EP)
ind0: U13.49(PF11) ; port PF11
ind1: U13.50(PF12) ; port PF12
ind2: U13.53(PF13) ; port PF13
ind3: U13.54(PF14) ; port PF14
MX1_N: U16.22(MX-) ; port TX-
MX1_P: U16.23(MX+) ; port TX+
MX3_N: U16.16(MX-) ; port RX-
MX3_P: U16.17(MX+) ; port RX+
NRST: J10.2 R61.2 U13.25(NRST) U15.1(~{RESET})
PA1_REF_CLK: R67.4 U13.35(REF_CLK=PA1)
PA2_MDIO: R65.2 U13.36(MDIO=PA2) U17.12(MDIO)
PA7_CSR_DV: R67.3 U13.43(CRS_DV=PA7)
PB11: R87.1 U13.70(PB11)
PB12: R89.1 U13.73(PB12)
PB13_TXD1: U13.74(TXD1=PB13) U17.18(TXD1)
PB14: R91.1 U13.75(PB14)
PB15: R93.1 U13.76(PB15)
PC1_MDC: U13.27(MDC=PC1) U17.13(MDC)
PC4_RXD0: R67.2 U13.44(RXDD0=PC4)
PC5_RXD1: R67.1 U13.45(RXD1=PC5)
PC9: R100.2 U13.98(PC8)
PC10: R101.2 U13.99(PC9)
PC11: R102.2 U13.111(PC10)
PC12: R103.2 U13.112(PC11)
PC13: R104.2 U13.113(PC12)
PC14: R105.2 U13.7(PC13)
PC15: R106.2 U13.8(PC14)
PC16: R107.2 U13.9(PC15)
PD8: R84.2 U13.77(PD8)
PD9: R85.2 U13.78(PD9)
PD10: R86.2 U13.79(PD10)
PD11: R88.2 U13.80(PD11)
PD12: R90.2 U13.81(PD12)
PD13: R92.2 U13.82(PD13)
PD14: R94.2 U13.85(PD14)
PD15: R95.2 U13.86(PD15)
PG11_TX_EN: U13.126(TX_EN=PG11) U17.16(TXEN)
PG13_TXD0: U13.128(TXD0=PG13) U17.17(TXD0)
ProbeEEPROM_SCL: R60.2 U13.11(SCL=PF1) ; port SCL
ProbeEEPROM_SDA: R59.2 U13.10(SDA=PF0) ; port SDA
RD_N: D5.1(IO1) R63.2 U16.9(TD-) U17.22(RXN)
RD_P: D5.3(IO2) R63.1 U16.8(TD+) U17.23(RXP)
TD_N: D5.4(IO3) R63.4 U16.3(TD-) U17.20(TXN)
TD_P: D5.6(IO4) R63.3 U16.2(TD+) U17.21(TXP)
VDDA_Eth: C71.1 C77.2 C78.2 C79.2 C82.2 C85.2 D5.5(Vcc) L14.1 R63.5 R63.6 R63.7 R63.8 U16.1(TCT) U16.4(TCT) U16.7(TCT) U16.10(TCT) U17.1(VDD2A) U17.19(VDD1A)
NetC18_2: C18.2 U13.71(VCAP_1)
NetC19_2: C19.2 U13.106(VCAP_2)
NetC60_2: C75.2 L12.1 L13.1 ; port +3V3D
NetC81_2: C81.2 C83.2 U17.6(VDDCR)
NetC87_1: C87.1 U17.4(XTAL2) X1.1(OSC1)
NetC88_1: C88.1 U17.5(XTAL1/CLKIN) X1.2(OSC2)
NetD2_1: D2.1(IO1) R58.1 U14.13(IN)
NetD2_3: D2.3(IO2) R53.1 U14.4(OUT)
NetD2_4: D2.4(IO3) R57.1 U14.11(IN)
NetD2_6: D2.6(IO4) R52.1 U14.2(OUT)
NetD3_1: D3.1(+) D4.1(+) ; port +V_POE
NetD3_2: D3.2(AC) U16.24(MCT)
NetD3_3: D3.3(-) D4.3(-) ; port -V_POE
NetD3_4: D3.4(AC) U16.18(MCT)
NetD4_2: D4.2(AC) U16.15(MCT)
NetD4_4: D4.4(AC) U16.21(MCT)
NetD7_2: D7.2(A) R81.2
NetD8_2: D8.2(A) R82.2
NetD9_2: D9.2(A) R83.2
NetJ4_2: R53.2 ; port UART_TX
NetJ4_3: R58.2 ; port UART_RX
NetJ5_4: U16.20(MX+) ; port P4
NetJ5_5: U16.19(MX-) ; port P5
NetJ5_7: U16.14(MX+) ; port P7
NetJ5_8: U16.13(MX-) ; port P8
NetJ5_9: U17.3(LED1/nINT/nPME/REGOFF) ; port LED1A
NetJ5_11: R69.1 U17.2(LED2/nINT/nPME/nINTSEL) ; port LED2A
NetJ10_1: J10.1 U17.15(nRST)
NetJ12_2: R74.2 ; port SWDIO
NetJ12_3: R75.2 ; port SWCLK
NetJ12_4: R76.2 ; port SWO
NetJ13_3: R87.2 ; port PB_11
NetJ13_4: R89.2 ; port PB_12
NetJ13_5: R91.2 ; port PB_13
NetJ13_6: R93.2 ; port PB_14
NetJ13_7: R84.1 ; port PD_8
NetJ13_8: R85.1 ; port PD_9
NetJ13_9: R86.1 ; port PD_10
NetJ13_10: R88.1 ; port PD_11
NetJ13_11: R90.1 ; port PD_12
NetJ13_12: R92.1 ; port PD_13
NetJ13_13: R94.1 ; port PD_14
NetJ13_14: R95.1 ; port PD_15
NetJ15_1: J15.1 R100.1
NetJ15_2: J15.2 R101.1
NetJ15_3: J15.3 R102.1
NetJ15_4: J15.4 R103.1
NetJ15_5: J15.5 R104.1
NetJ15_6: J15.6 R105.1
NetJ15_7: J15.7 R106.1
NetJ15_8: J15.8 R107.1
NetOSC1_1: OSC1.1(~{D}E) R56.2
NetOSC1_4: OSC1.4(OUT) R54.1 U13.23(PH0)
NetPB1_1: PB1.1(C) U15.3(~{MR})
NetQ2_4: R51.1 U13.141(PE0) ; port ~{POE_OK}
NetR11_1: R11.1 U3.5(WP)
NetR13_2: U13.14(PF4) ; port ADCGain1
NetR15_2: U13.15(PF5) ; port ADCGain0
NetR16_2: U13.69(MISO=PB10) ; port MISO/READY
NetR17_2: U13.28(SCLK=PC2) ; port SCLK
NetR18_2: U13.22(PF10) ; port ADCReset
NetR21_1: R54.2 R55.2 ; port ADCClock
NetR24_2: U13.21(PF9) ; port ADCSpeed
NetR26_2: U13.12(PF2) ; port ADCMux0
NetR27_2: U13.13(PF3) ; port ADCMux1
NetR36_1: U13.18(PF6) ; port CalibrMux0
NetR37_1: U13.19(PF7) ; port CalibrMux1
NetR38_1: U13.20(PF8) ; port CalibrMux2
NetR52_2: R52.2 U14.3(IN)
NetR55_1: R55.1 U13.97(PC7)
NetR57_2: R57.2 U14.12(OUT)
NetR62_2: R62.2 U15.4(CT)
NetR64_2: R64.2 R67.5 U17.14(nINT/REFCLK0)
NetR66_1: R66.1 R67.6 U17.11(CRS_DV/MODE2)
NetR66_2: R66.2 U17.10(RXER/PHYAD0)
NetR66_3: R66.3 R67.7 U17.8(RXD0/MODE0)
NetR66_4: R66.4 R67.8 U17.7(RXD1/MODE1)
NetR68_2: R68.2 U17.24(RBIAS)
NetR70_1: R70.1 U3.3(SDA) U13.140(SDA=PB9)
NetR71_1: R71.1 U3.1(SCL) U13.139(SCL=PB8)
NetR73_1: R73.1 R75.1 U13.109(SWCLK=PA14)
NetR74_1: R74.1 U13.105(SWDIO=PA13)
NetR76_1: R76.1 U13.133(SWO=PB3)
NetR77_1: R77.1 R99.1 U13.138(BOOT0)
NetR81_1: R81.1 U13.56(PG0)
NetR82_1: R82.1 U13.57(PG1)
NetR83_1: R83.1 U13.88(PG3)
NetR97_1: R97.1 R98.1 U13.48(BOOT1=PB2)
NetU13_101: U13.101(TX=PA9) U14.1(IN)
NetU13_102: U13.102(RX=PA10) U14.10(OUT)

Not connected (* = marked no-connect by the designer): U13 1(PE2) 2(PE3) 3(PE4) 4(PE5) 5(PE6) 24(PH1) 26(~{CS=PC0})* 29(MOSI=PC3)* 34(PA0) 37(PA3) 40(PA4) 41(PA5) 42(PA6) 46(PB0) 47(PB1) 55(PF15) 58(PE7) 59(PE8) 60(PE9) 63(PE10) 64(PE11) 65(PE12) 66(PE13) 67(PE14) 68(PE15) 87(PG2) 89(PG4) 90(PG5) 91(PG6) 92(PG7) 93(PG8) 100(PA8) 103(PA11) 104(PA12) 110(PA15) 114(PD0) 115(PD1) 116(PD2) 117(PD3) 118(PD4) 119(PD5) 122(PD6) 123(PD7) 125(PG10) 127(PG12) 129(PG14) 132(PG15) 134(PB4) 135(PB5) 136(PB6) 137(PB7) 142(PE1); U14 6(OUT) 8(OUT); U16 5(TD+)* 6(TD-)* 11(TD+)* 12(TD-)*

### Layout directives
differential pair: MX1_N, MX1_P, MX3_N, MX3_P, RD_N, RD_P, TD_N, TD_P
rule Matched Net Lengths [Tolerance = 100mil]: RD_N, RD_P, TD_N, TD_P

### Notes on the sheet
- Labels drawn without touching a wire or pin: 3V3 Ethernet, Vin+POE, Vin-POE
- Подп. и дата
- Инв. № дубл.
- Взам. инв. №
- Инв. № подл.
- Изм.
- Лист
- № докум.
- Подп.
- Дата
- Копировал
- Формат А2
- (in symbol H5007NL) CHANNEL 1; CHANNEL 2; CHANNEL 3; CHANNEL 4
- (in symbol STM32F756ZGT6, part D) Ethernet
- (in symbol STM32F756ZGT6, part F) I2C2
- (in symbol STM32F756ZGT6, part G) SPI2
- (in symbol STM32F756ZGT6, part H) I2C1
- (in symbol STM32F756ZGT6, part I) UART1
- (in symbol STM32F756ZGT6, part J) SW

### Library data of the parts
C16 C17 C67-C78 C80 C82-C85 C89-C103 = C0603: as C25 on sheet ADC; Price: 2
  C16 C17 C67-C74 C76-C78 C80 C82-C85 C89-C103: Value: 33nF
  C75: Value: 1uF
C18 C19 C79 C86 = C0805: as C27 on sheet ADC; Price: 2
  C18 C19: Value: 2.2uF
  C79 C86: Value: 10uF
C81 C87 C88 = C0603: Чип конденсатор 0603; Voltage: 50V; Vendor: Vishay; DielectricType: NPO; SMD Solders: 2; Solder Option: RM; Tolerance: 20%; Pkg: SMD0603; Device: Cap603; Price: 2
  C81: Value: 470pF
  C87 C88: Value: 30pF
D2 D5 = IP4220: as D12 on sheet ADC; Device: IP4220CZ6; Price: 10; Name to order: IP4220CZ6; Current: 0
D3 D4 = W02G: Diode Bridge Rectifier; Vendor: multicomp; SMD Solders: 0; Solder Option: RM; THD Solders: 4; Voltage: 200V; Pkg: W02G; Price: 20; Device: W02G; Name to order: W02G
D7-D9 = LED0805: Чип светодиод 0805; Vendor: KB; SMD Solders: 2; Solder Option: RM; Pkg: SMD0805; THD Solders: 0; Price: 10; Device: LED0805
  D7: Value: OK
  D8: Value: ERR
  D9: Value: ANY
J10 = JmpPCB: PLS2; SMD Solders: 1; Solder Option: i; THD Solders: 0; Price: 1; Vendor: -; Device: JmpPCB
J15 = PLS8: Вилка  PLS8/2.54; Vendor: Confly; SMD Solders: 0; Solder Option: RM; THD Solders: 8; Price: 20; Device: PLS8
L12-L14 = BLM21: as L3 on sheet ADC; Price: 10; Device: BLM21
OSC1 = XLH730: Генератор кварцевый; Vendor: Renesas; Pkg: 7x5mm; SMD Solders: 2; Solder Option: RM; THD Solders: 0; Name to order: XLH730004.915200I; Value: 4.9152MHz; Price: 400; Device: XLH730; Current: 0
PB1 = PBAngle: Push Button Angle NO; Vendor: TE Conn; SMD Solders: 0; Solder Option: RM; Pkg: 7x7mm; THD Solders: 4; Price: 1; Device: PushButt; Name to order: 2-1825027-0
R11 R51-R54 R57 R58 R71 R73-R76 R81-R95 = R0805: as R39 on sheet main; Price: 2
  R11: Value: 1k
  R51: Value: 27k
  R52 R53 R57 R58 R74-R76 R84-R95: Value: 100
  R54: Value: 0
  R71: Value: 1k5
  R73 R81-R83: Value: 10k
R55 R56 = R0805: as R14 on sheet ADC; Price: 2
  R55: Value: 0
  R56: Value: 1k
R59-R62 R64 R65 R68 R69 R77 R97-R99 = R0603: as R40 on sheet main; Price: 2
  R59 R60 R65: Value: 1k5
  R61: Value: .20k
  R62: Value: .100k
  R64 R69: Value: 10k
  R68: Value: 12k1
  R77 R97-R99: Value: 4k7
R63 = CAY16: Сборка из 4х чип резисторов; Vendor: Bourns; SMD Solders: 8; Solder Option: RM; TC: 200ppm/C; Tolerance: 5%; Pkg: so8-80; Pwr: 60mW; THD Solders: 0; Name to order: CAY16-510j4  or CAY16-510F4; Price: 2; Value: 49.9; Device: CAY16
R66 = CAY16: Сборка из 4х чип резисторов; Vendor: Bourns; SMD Solders: 8; Solder Option: RM; TC: 200ppm/C; Tolerance: 5%; Pkg: so8-80; Pwr: 60mW; THD Solders: 0; Name to order: CAY16-10k0j4; Price: 2; Value: 10k; Device: CAY16
R67 = CAY16: Сборка из 4х чип резисторов; Vendor: Bourns; SMD Solders: 8; Solder Option: RM; TC: 200ppm/C; Tolerance: 5%; Pkg: so8-80; Pwr: 60mW; THD Solders: 0; Name to order: CAY16-330j4; Price: 2; Value: 33; Device: CAY16
R70 = R0805: Чип резистор 0603; Vendor: Vishay; SMD Solders: 2; Solder Option: RM; TC: 100ppm/C; Tolerance: 1%; Pkg: SMD0603; Pwr: 60mW; Device: Res603; Price: 2; Value: 1k5
R100-R107 = R0603: Чип резистор 0603; Vendor: Vishay; SMD Solders: 2; TC: 100ppm/C; Tolerance: 1%; Pkg: SMD0603; Pwr: 60mW; Device: Res603; Price: 2; Value: DNP; Solder Option: DNP
U3 = AT24C: Isolateted DC DC 5V->5V or 3V3 60mA; Vendor: HGSemi; Value: 16M5; SMD Solders: 5; Solder Option: RM; THD Solders: 0; Name to order: AT24C16M5/TR; Current: 2uA/2mA; Pkg: SOT23-5; Price: 20; Device: AT24C16
U13 = STM32F756ZGT6: High-performance and DSP with FPU, Arm Cortex-M7 MCU with 1 Mbyte of Flash memory, 216 MHz CPU, Art Accelerator, L1 cache, HW crypto, SDRAM, TFT; Manufacturer_Name: STMicroelectronics; SMD Solders: 144; THD Solders: 0; Pkg: LQFP144; Copyright: Copyright (C) 2025 Ultra Librarian. All rights reserved.; Manufacturer_Part_Number: STM32F756ZGT6; Datasheet: https://www.st.com/resource/en/datasheet/stm32f756bg.pdf; RefDes: RefDes; Type: Type; `: *; Price: 4000
U14 = 74HC14D: 6 триггеров Шмита с инверсией.; Vendor: NXP; Pkg: SOIC14; SMD Solders: 14; Solder Option: RM; Voltage: 2.. 6V; Price: 50; Device: 74HC14D; Name to order: 74HC14D
U15 = TPS3808: Supervisory Circuit. Low-Quiescent-Current, Programmable-Delay; Vendor: Texas Instruments; Value: 3V3; Pkg: SOT23-6; SMD Solders: 6; Solder Option: RM; THD Solders: 0; Name to order: TPS3808G33DBV; Current: 6uA; thVoltage: 3070mV; Price: 200; Device: TPS3808
U16 = H5007NL: Ethernet transformer IEEE 802.3; Vendor: Yageo; Pkg: SO24-1.27; SMD Solders: 24; Solder Option: RM; THD Solders: 0; Price: 400; Device: H5007NL; Name to order: H5007NL; Current: 0
U17 = LAN8742: Supervisory Circuit. Low-Quiescent-Current, Programmable-Delay; Vendor: MicroChip; Pkg: VQFN25-0.50; SMD Solders: 25; Solder Option: i; THD Solders: 0; Current: 6uA; Price: 700; Device: LAN8742A-CZ; Name to order: LAN8742A-CZ
X1 = AA-25: Резонатор кварцевый; Vendor: TXS; Pkg: 5x3,2; SMD Solders: 2; Solder Option: RM; Device: AA-; THD Solders: 0; Name to order: AA-25.000MALE-T; Value: 25.000MHz; Price: 300; Current: 0

## Sheet Power.SchDoc
size 420 x 297 mm; Address1: Address1; Address2: Address2; Address3: Address3; Address4: Address4; SheetNumber: 1; Scale: 1:1; Разраб.: Иванов; Обозначение документа: Power; Пров.: Петров; Утв.: Сидоров; Наименование организации: ОАО "Концерн "МПО-Гидроприбор"; Перв. применение: АБВГ.123456.000; Наименование изделия 1: Плата; Наименование изделия 2: Схема электрическая; Наименование изделия 3: принципиальная; Нач. отд.: Нач. отд.; Фамилия нач. отд.: Сидоров
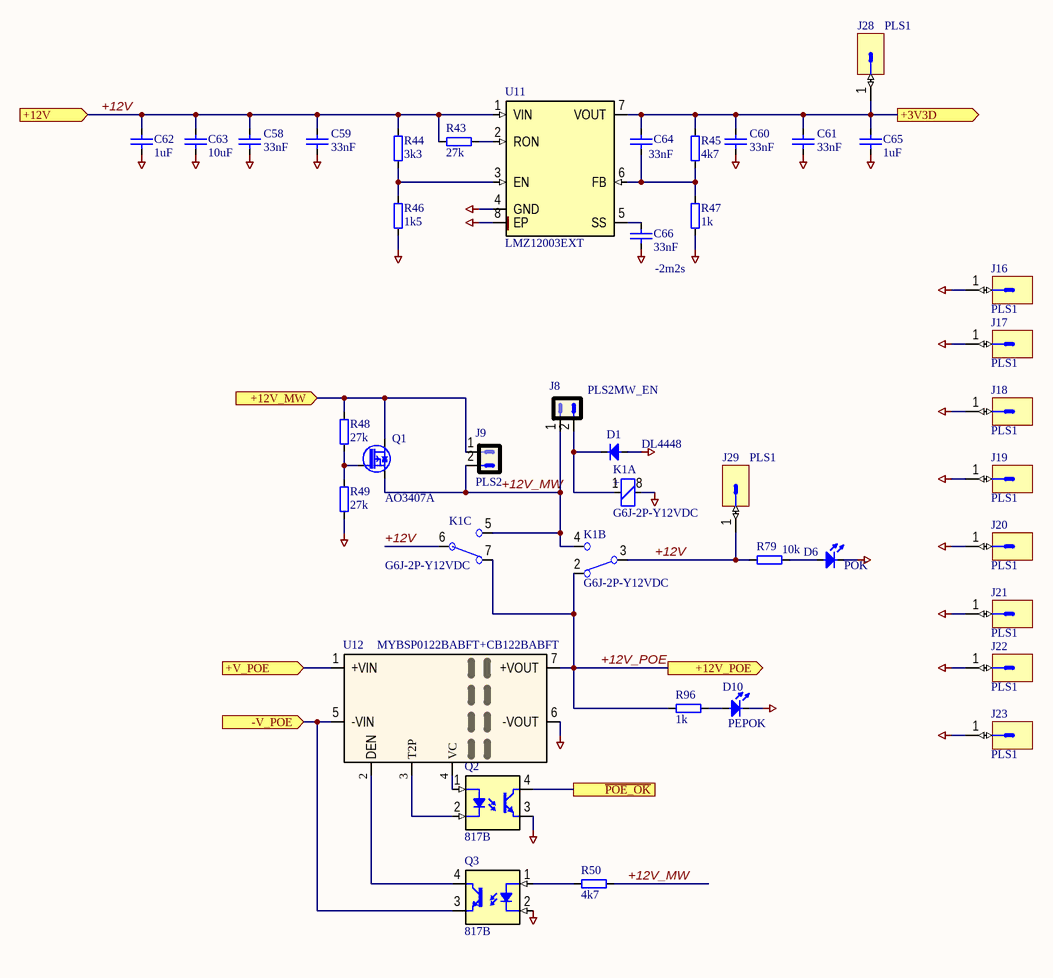
[diagram p4: Power.SchDoc]

### Parts
C58  33nF  [CAPC1608X87N]
C59  33nF  [CAPC1608X87N]
C60  33nF  [CAPC1608X87N]
C61  33nF  [CAPC1608X87N]
C62  1uF  [SMD0805CAP]
C63  10uF  [SMD0805CAP]
C64  33nF  [SMD0805CAP]
C65  1uF  [SMD0805CAP]
C66  33nF  [CAPC1608X87N]
D1  DL4448  [DIOMELF3515N]
D6  POK  [LED_OSRAM_LGR971]
D10  PEPOK  [LED_OSRAM_LGR971]
J8  PLS2MW_EN  [PLS2]
J9  PLS2  [PLS2]
J16  PLS1  [PLS1]
J17  PLS1  [PLS1]
J18  PLS1  [PLS1]
J19  PLS1  [PLS1]
J20  PLS1  [PLS1]
J21  PLS1  [PLS1]
J22  PLS1  [PLS1]
J23  PLS1  [PLS1]
J28  PLS1  [PLS1]
J29  PLS1  [PLS1]
K1  G6J-2P-Y12VDC  [REL_OMRON_G6J-2P-Y]  (parts A,B,C of 3)
Q1  AO3407A  [SOT95P229X119-3N]
Q2  817B  [DIP4-300]
Q3  817B  [DIP4-300]
R43  27k  [SMD0805RES]
R44  3k3  [SMD0805RES]
R45  4k7  [RESC1608X64N]
R46  1k5  [SMD0805RES]
R47  1k  [SMD0805RES]
R48  27k  [SMD0805RES]
R49  27k  [SMD0805RES]
R50  4k7  [SMD0805RES]
R79  10k  [SMD0805RES]
R96  1k  [SMD0805RES]
U11  LMZ12003EXT  [NATIONAL_TO-PMOD-7 (TZA07A)]
U12  MYBSP0122BABFT+CB122BABFT  [MURATA_MYBSP0122BABFT_0 - DUPLICATE]

### Ports
+3V3D (out), +12V (in), +12V_MW (in), +12V_POE (out), +V_POE (in), -V_POE (in), ~{POE_OK}

### Nets
GND: C58.1 C59.1 C60.1 C61.1 C62.1 C63.1 C65.1 C66.1 D1.2(A) D6.1(C) D10.1(C) J16.1 J17.1 J18.1 J19.1 J20.1 J21.1 J22.1 J23.1 K1.8 Q2.3(E) Q3.2(C) R46.2 R47.2 R49.2 U11.4(GND) U11.8(EP) U12.6(-VOUT)
+12V: C58.2 C59.2 C62.2 C63.2 J29.1 K1.3(C) K1.6(C) R43.1 R44.1 R79.1 U11.1(VIN) ; port +12V
+12V_MW: J8.1 J9.2 K1.4(NO) K1.5(NO) Q1.2(S) R50.2
+12V_POE: K1.2(NC) K1.7(NC) R96.1 U12.7(+VOUT) ; port +12V_POE
NetC60_2: C60.2 C61.2 C64.2 C65.2 J28.1 R45.1 U11.7(VOUT) ; port +3V3D
NetC64_1: C64.1 R45.2 R47.1 U11.6(FB)
NetC66_2: C66.2 U11.5(SS)
NetD1_1: D1.1(C) J8.2 K1.1
NetD3_1: U12.1(+VIN) ; port +V_POE
NetD3_3: Q3.3(E) U12.5(-VIN) ; port -V_POE
NetD6_2: D6.2(A) R79.2
NetD10_2: D10.2(A) R96.2
NetJ7_3: J9.1 Q1.3(D) R48.1 ; port +12V_MW
NetQ1_1: Q1.1(G) R48.2 R49.1
NetQ2_1: Q2.1(A) U12.4(VC)
NetQ2_2: Q2.2(C) U12.3(T2P)
NetQ2_4: Q2.4(C) ; port ~{POE_OK}
NetQ3_1: Q3.1(A) R50.1
NetQ3_4: Q3.4(C) U12.2(DEN)
NetR43_2: R43.2 U11.2(RON)
NetR44_2: R44.2 R46.1 U11.3(EN)

### Notes on the sheet
- -2m2s
- Подп. и дата
- Инв. № дубл.
- Взам. инв. №
- Инв. № подл.
- Изм.
- Лист
- № докум.
- Подп.
- Дата
- Копировал
- Формат А3
- (in symbol G6J-2P-Y 12VDC, part A) +

### Library data of the parts
C58-C61 C66 = C0603: as C25 on sheet ADC; Value: 33nF; Price: 2
C62-C65 = C0805: as C27 on sheet ADC; Price: 2
  C62 C65: Value: 1uF
  C63: Value: 10uF
  C64: Value: 33nF
D1 = DL4448: Fast diode; SMD Solders: 2; Vendor: Shenzhen Luguang Electronic Technology; Voltage: 100; Solder Option: RM; Pkg: MiniMelf (DL35); Name to order: SF18; Current: 150; Price: 10; Device: DL4448
D6 D10 = LED0805: as D7 on sheet uC; Price: 10; Device: LED0805
  D6: Value: POK
  D10: Value: PEPOK
J8 = PLS2: Vendor: Confly; Value: MW_EN; SMD Solders: 0; Solder Option: RM; THD Solders: 2; Price: 1; Device: PLS2
J9 = PLS2: as J1 on sheet CurrentSrc; Price: 1; Device: PLS2
J16-J23 J28 J29 = PLS1: as J2 on sheet ADC; Price: 1; Device: PLS1
K1 = G6J-2P-Y 12VDC: Электромагнитное реле; Vendor: Omron; Voltage: 110V; SMD Solders: 0; Solder Option: RM; Pkg: 11x6mm; THD Solders: 8; Current: 9mA; Value: 12VDC; Price: 200; Device: G6J-2P-Y; Name to order: G6J-2P-Y 12VDC
Q1 = AO3407A: PMOS; Vendor: UMW; Pkg: SOT23; SMD Solders: 3; Solder Option: RM; THD Solders: 0; Voltage: -30V; Price: 10; Device: AO3407A; Name to order: AO3407A
Q2 Q3 = 817B: Optotransistor; Pkg: DIP4; SMD Solders: 0; Solder Option: RM; THD Solders: 4; Vendor: UMW; Voltage: 35V; Device: 817B; Price: 10; Name to order: 817B; Current: 0
R43 R44 R46-R50 R79 R96 = R0805: as R39 on sheet main; Price: 2
  R43 R48 R49: Value: 27k
  R44: Value: 3k3
  R46: Value: 1k5
  R47 R96: Value: 1k
  R50: Value: 4k7
  R79: Value: 10k
R45 = R0603: as R40 on sheet main; Price: 2; Value: 4k7
U11 = LMZ12003: DC-DC Power Module; Vendor: Texas Instruments; Pkg: NDW 7; SMD Solders: 8; Solder Option: EXT; THD Solders: 0; Price: 11000; Device: LMZ12003; Name to order: LMZ12003EXT; thVoltage: -; PkgCode: EXT
U12 = MYBSP0122BABFT: POE isolated DC-DC 24W; Vendor: Murata; SMD Solders: 7; Solder Option: RM; Pkg: 35x23mm; Voltage: +12V; THD Solders: 0; Name to order: MYBSP0; Value: 122BABFT; Price: 1000; Device: MYBSP0122BABFT+CB

## Nets that join several sheets
3V3uC: main (J6.8 J13.2), uC (58 pins)
GND: main (17 pins), ADC (51 pins), CurrentSrc (38 pins), uC (69 pins), Power (28 pins)
+12V: main (R78.2 R112.2), ADC (L5.1 L7.1 L9.2 L10.1), CurrentSrc (L1.1), Power (11 pins)
+12V_POE: main (R80.2 R110.2), Power (K1.2 K1.7 R96.1 U12.7)
Hal_current_2mA: main (J6.2), CurrentSrc (6 pins)
ind0: main (R113.2), uC (U13.49)
ind1: main (R111.2), uC (U13.50)
ind2: main (R109.2), uC (U13.53)
ind3: main (R108.2), uC (U13.54)
iT+: main (J6.9), ADC (U9.4), CurrentSrc (6 pins)
iT-: main (J6.10), ADC (U9.13), CurrentSrc (J11.1)
MX1_N: main (J5.2), uC (U16.22)
MX1_P: main (J5.1), uC (U16.23)
MX3_N: main (J5.6), uC (U16.16)
MX3_P: main (J5.3), uC (U16.17)
NetC60_2: uC (C75.2 L12.1 L13.1), Power (7 pins)
NetD3_1: uC (D3.1 D4.1), Power (U12.1)
NetD3_3: uC (D3.3 D4.3), Power (Q3.3 U12.5)
NetJ1_1: ADC (R30.1), CurrentSrc (J1.1 R6.1 R8.1)
NetJ4_2: main (J4.2), uC (R53.2)
NetJ4_3: main (J4.3), uC (R58.2)
NetJ5_4: main (J5.4), uC (U16.20)
NetJ5_5: main (J5.5), uC (U16.19)
NetJ5_7: main (J5.7), uC (U16.14)
NetJ5_8: main (J5.8), uC (U16.13)
NetJ5_9: main (J5.9), uC (U17.3)
NetJ5_11: main (J5.11), uC (R69.1 U17.2)
NetJ6_1: main (J6.1), ADC (R29.1), CurrentSrc (R6.2 R8.2)
NetJ7_3: main (J7.3 J7.4), Power (J9.1 Q1.3 R48.1)
NetJ12_2: main (J12.2), uC (R74.2)
NetJ12_3: main (J12.3), uC (R75.2)
NetJ12_4: main (J12.4), uC (R76.2)
NetJ13_3: main (J13.3), uC (R87.2)
NetJ13_4: main (J13.4), uC (R89.2)
NetJ13_5: main (J13.5), uC (R91.2)
NetJ13_6: main (J13.6), uC (R93.2)
NetJ13_7: main (J13.7), uC (R84.1)
NetJ13_8: main (J13.8), uC (R85.1)
NetJ13_9: main (J13.9), uC (R86.1)
NetJ13_10: main (J13.10), uC (R88.1)
NetJ13_11: main (J13.11), uC (R90.1)
NetJ13_12: main (J13.12), uC (R92.1)
NetJ13_13: main (J13.13), uC (R94.1)
NetJ13_14: main (J13.14), uC (R95.1)
NetQ2_4: uC (R51.1 U13.141), Power (Q2.4)
NetR13_2: ADC (R13.2), uC (U13.14)
NetR15_2: ADC (R15.2), uC (U13.15)
NetR16_2: ADC (R16.2), uC (U13.69)
NetR17_2: ADC (R17.2), uC (U13.28)
NetR18_2: ADC (R18.2), uC (U13.22)
NetR21_1: ADC (R21.1 U6.3), uC (R54.2 R55.2)
NetR24_2: ADC (R24.2), uC (U13.21)
NetR26_2: ADC (R26.2), uC (U13.12)
NetR27_2: ADC (R27.2), uC (U13.13)
NetR36_1: ADC (R36.1), uC (U13.18)
NetR37_1: ADC (R37.1), uC (U13.19)
NetR38_1: ADC (R38.1), uC (U13.20)
ProbeEEPROM_SCL: main (J6.14), uC (R60.2 U13.11)
ProbeEEPROM_SDA: main (J6.7), uC (R59.2 U13.10)
VHall1N: main (J6.11), ADC (R23.1)
VHall1P: main (J6.12), ADC (R20.1)
VHall2N: main (J6.3), ADC (R28.1)
VHall2P: main (J6.4), ADC (R25.1)